# Altium project MB1419.PrjPcb (part 1 of 2)
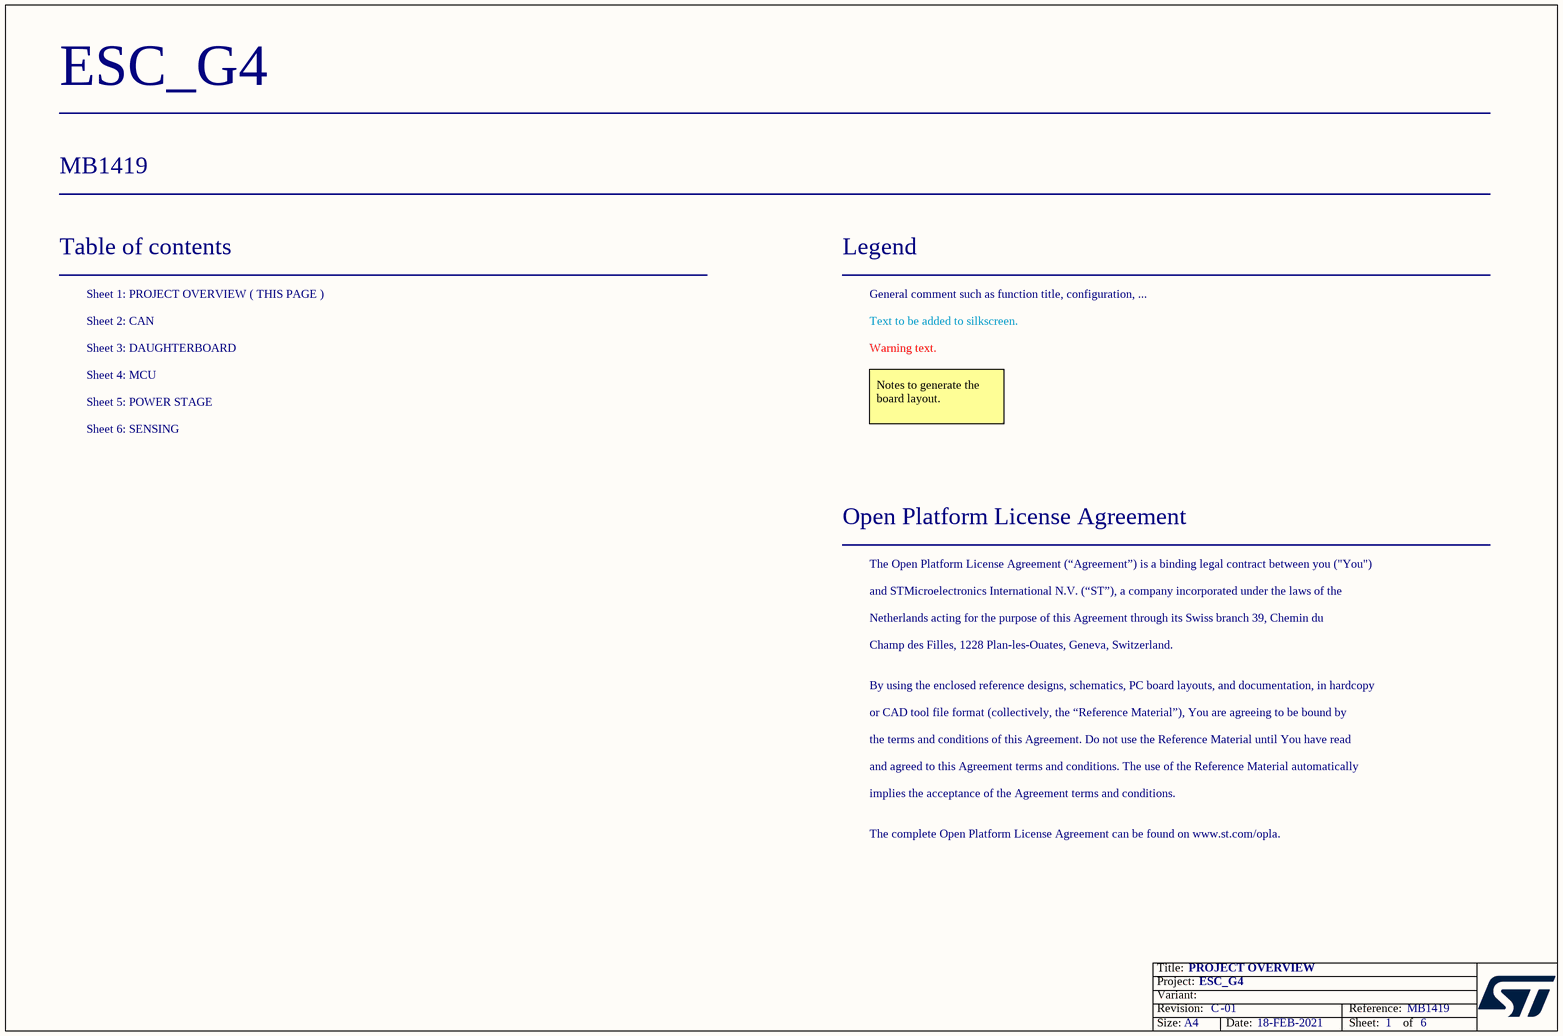
[diagram p0: Project_Overview.SchDoc]
Board_Reference: MB1419; Board_PCB_Revision: C; Board_Name: ESC_G4; Board_Document_Date: 18-FEB-2021; Board_Assembly_Revision: 01
6 sheets, 211 parts. Net scope: global (net labels, ports and power ports of the same name join across sheets).
Board file: MB1419.PcbDoc
Sheets:
  Project_Overview.SchDoc
  CAN.SchDoc
  DAUGHTERBOARD.SchDoc
  MCU.SchDoc
  POWER STAGE.SchDoc
  SENSING.SchDoc

## Sheet Project_Overview.SchDoc: PROJECT OVERVIEW
size A4; Date: Not used; ApprovedBy: Not used; CheckedBy: Not used; Author: Not used; CompanyName: STMicroelectronics; DrawnBy: Not used; Engineer: Not used; Organization: Not used; Address1: Not used; Address2: Not used; Address3: Not used; Address4: Not used; DocumentNumber: 1; Revision: Not used; SheetNumber: 1; SheetTotal: 6; CurrentTime: Not used; CurrentDate: Not used; Time: Not used; DocumentFullPathAndName: Not used; DocumentName: Not used; ModifiedDate: Not used; ImagePath: Not used; ProjectName: Not used; Application_BuildNumber: Not used

### Notes on the sheet
- Table of contents
- Sheet 1: PROJECT OVERVIEW ( THIS PAGE )
- Legend
- General comment such as function title, configuration, ...
- Sheet 2: CAN
- Sheet 3: DAUGHTERBOARD
- Sheet 4: MCU
- Text to be added to silkscreen.
- Warning text.
- Sheet 6: SENSING
- Sheet 5: POWER STAGE
- Notes to generate the board layout.
- Open Platform License Agreement
- The Open Platform License Agreement (“Agreement”) is a binding legal contract between you ("You")
- and STMicroelectronics International N.V. (“ST”), a company incorporated under the laws of the
- Netherlands acting for the purpose of this Agreement through its Swiss branch 39, Chemin du
- Champ des Filles, 1228 Plan-les-Ouates, Geneva, Switzerland.
- By using the enclosed reference designs, schematics, PC board layouts, and documentation, in hardcopy
- or CAD tool file format (collectively, the “Reference Material”), You are agreeing to be bound by
- the terms and conditions of this Agreement. Do not use the Reference Material until You have read
- and agreed to this Agreement terms and conditions. The use of the Reference Material automatically
- implies the acceptance of the Agreement terms and conditions.
- The complete Open Platform License Agreement can be found on www.st.com/opla.
- Title:
- Project:
- Size:
- Revision:
- Variant:
- A4
- -
- Date:
- Reference:
- Sheet:
- of

## Sheet CAN.SchDoc: CAN
size A4; DocumentNumber: 2; SheetNumber: 2; SheetTotal: 6
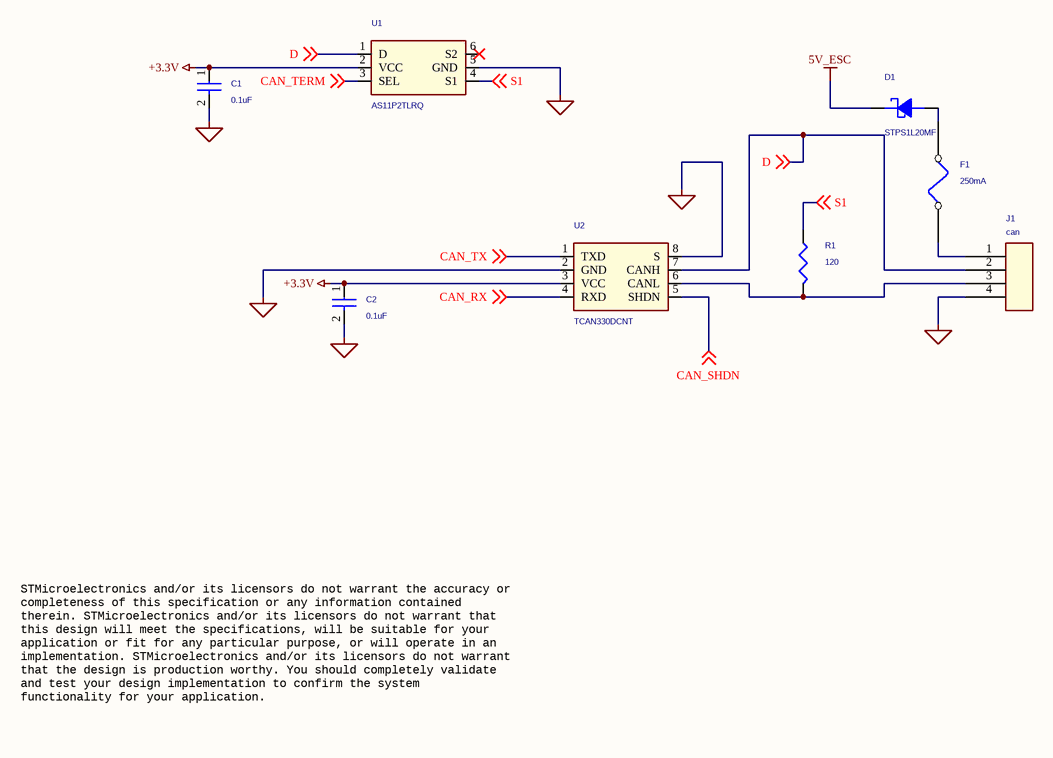
[diagram p1: CAN.SchDoc]

### Parts
C1  0.1uF  [C_0402]
C2  0.1uF  [C_0402]
D1  STPS1L20MF  [do216-aa-flat]
F1  250mA  [f_0402]
J1  can  [SOLDER_PAD_4PIN_SMD]
R1  120  [R_0402]
U1  AS11P2TLRQ  [son6p40_120x100x55l35x20]
U2  TCAN330DCNT  [sot23-8p65_280x145l45x30n]

### Nets
5V_ESC: D1.C
+3.3V: C1.1 C2.1 U1.2(VCC) U2.3(VCC)
GND_SIGNAL: C1.2 C2.2 J1.4 U1.5(GND) U2.2(GND) U2.8(S)  [project net GND]
CAN_RX: U2.4(RXD) ; off-sheet CAN_RX
CAN_SHDN: U2.5(SHDN) ; off-sheet CAN_SHDN
CAN_TERM: U1.3(SEL) ; off-sheet CAN_TERM
CAN_TX: U2.1(TXD) ; off-sheet CAN_TX
D: J1.2 U1.1(D) U2.7(CANH) ; off-sheet D
S1: R1.1 U1.4(S1) ; off-sheet S1
NetD1_A: D1.A F1.2
NetF1_1: F1.1 J1.1
NetJ1_3: J1.3 R1.2 U2.6(CANL)

Not connected (* = marked no-connect by the designer): U1 6(S2)*

### Notes on the sheet
- STMicroelectronics and/or its licensors do not warrant the accuracy or
  completeness of this specification or any information contained
  therein. STMicroelectronics and/or its licensors do not warrant that
  this design will meet the specifications, will be suitable for your
  application or fit for any particular purpose, or will operate in an
  implementation. STMicroelectronics and/or its licensors do not warrant
  that the design is production worthy. You should completely validate
  and test your design implementation to confirm the system
  functionality for your application.
- Title:
- Project:
- Size:
- Revision:
- Variant:
- A4
- -
- Date:
- Reference:
- Sheet:
- of

### Library data of the parts
C1 C2 = CAP_Dup1: CAP CER 0.1UF 16V X7R 0402; PART_NUMBER: CAP-00000053; Manufacturer: Wurth Electronics Inc.; Manufacturer PN: 885012205037; Dielectric Type: Capacitors; Tolerance: 10%; CLASS: DISCRETE; Package Size: 0402 (1005 Metric); Temperature Coefficient: X7R; Rated Voltage: 16V
D1 = DIODE_SCHOTTKY_0: DIODE SCHOTTKY 20V 1A STMITEFLAT; Manufacturer: STMicroelectronics; PART_NUMBER: TMP-380; CLASS: DISCRETE; Rated Voltage: 430mV @ 1A; Manufacturer PN: STPS1L20MF; Package Size: DO-222AA
F1 = FUSE: FUSE BOARD MNT 250MA 32VDC 0402; Manufacturer Code: 0435.250KRS; Manufacturer: Littelfuse Inc.; PART_NUMBER: TMP-439; RS/Distrelec/Other Code: MOUSER: 576-0435.250KRS; CLASS: DISCRETE; Package Size: 0.039" L x 0.020" W x 0.013" H (0.99mm x 0.51mm x 0.33mm); Manufacturer PN: 0435.250KRS
J1 = CON4: SOLDER PADS
R1 = RES: RES SMD 120 OHM 1% 1/16W 0402; PART_NUMBER: TMP-441; Manufacturer: Yageo; Manufacturer PN: RC0402FR-07120RL; Temperature Coefficient: 100ppm/C; Rated Power: 0.063W, 1/16W; CLASS: DISCRETE; Package Size: 0402 (1005 Metric); Tolerance: 1%
U1 = AS11P2TLR: IC ANLG SWITCH SGL SPDT 6QFN; Manufacturer: STMicroelectronics; PART_NUMBER: TMP-378; Manufacturer PN: AS11P2TLRQ; CLASS: IC; Package Size: 6-UFDFN
U2 = TCAN330: IC TXRX CAN 3.3V SOT-23; PART_NUMBER: TMP-379; Manufacturer: Texas Instruments; Supply Voltage: 3 V ~ 3.6 V; Package Size: SOT-23-8; CLASS: IC; Manufacturer PN: TCAN330DCNT

## Sheet DAUGHTERBOARD.SchDoc: Daughterboard
size A3; DocumentNumber: 3; SheetNumber: 3; SheetTotal: 6
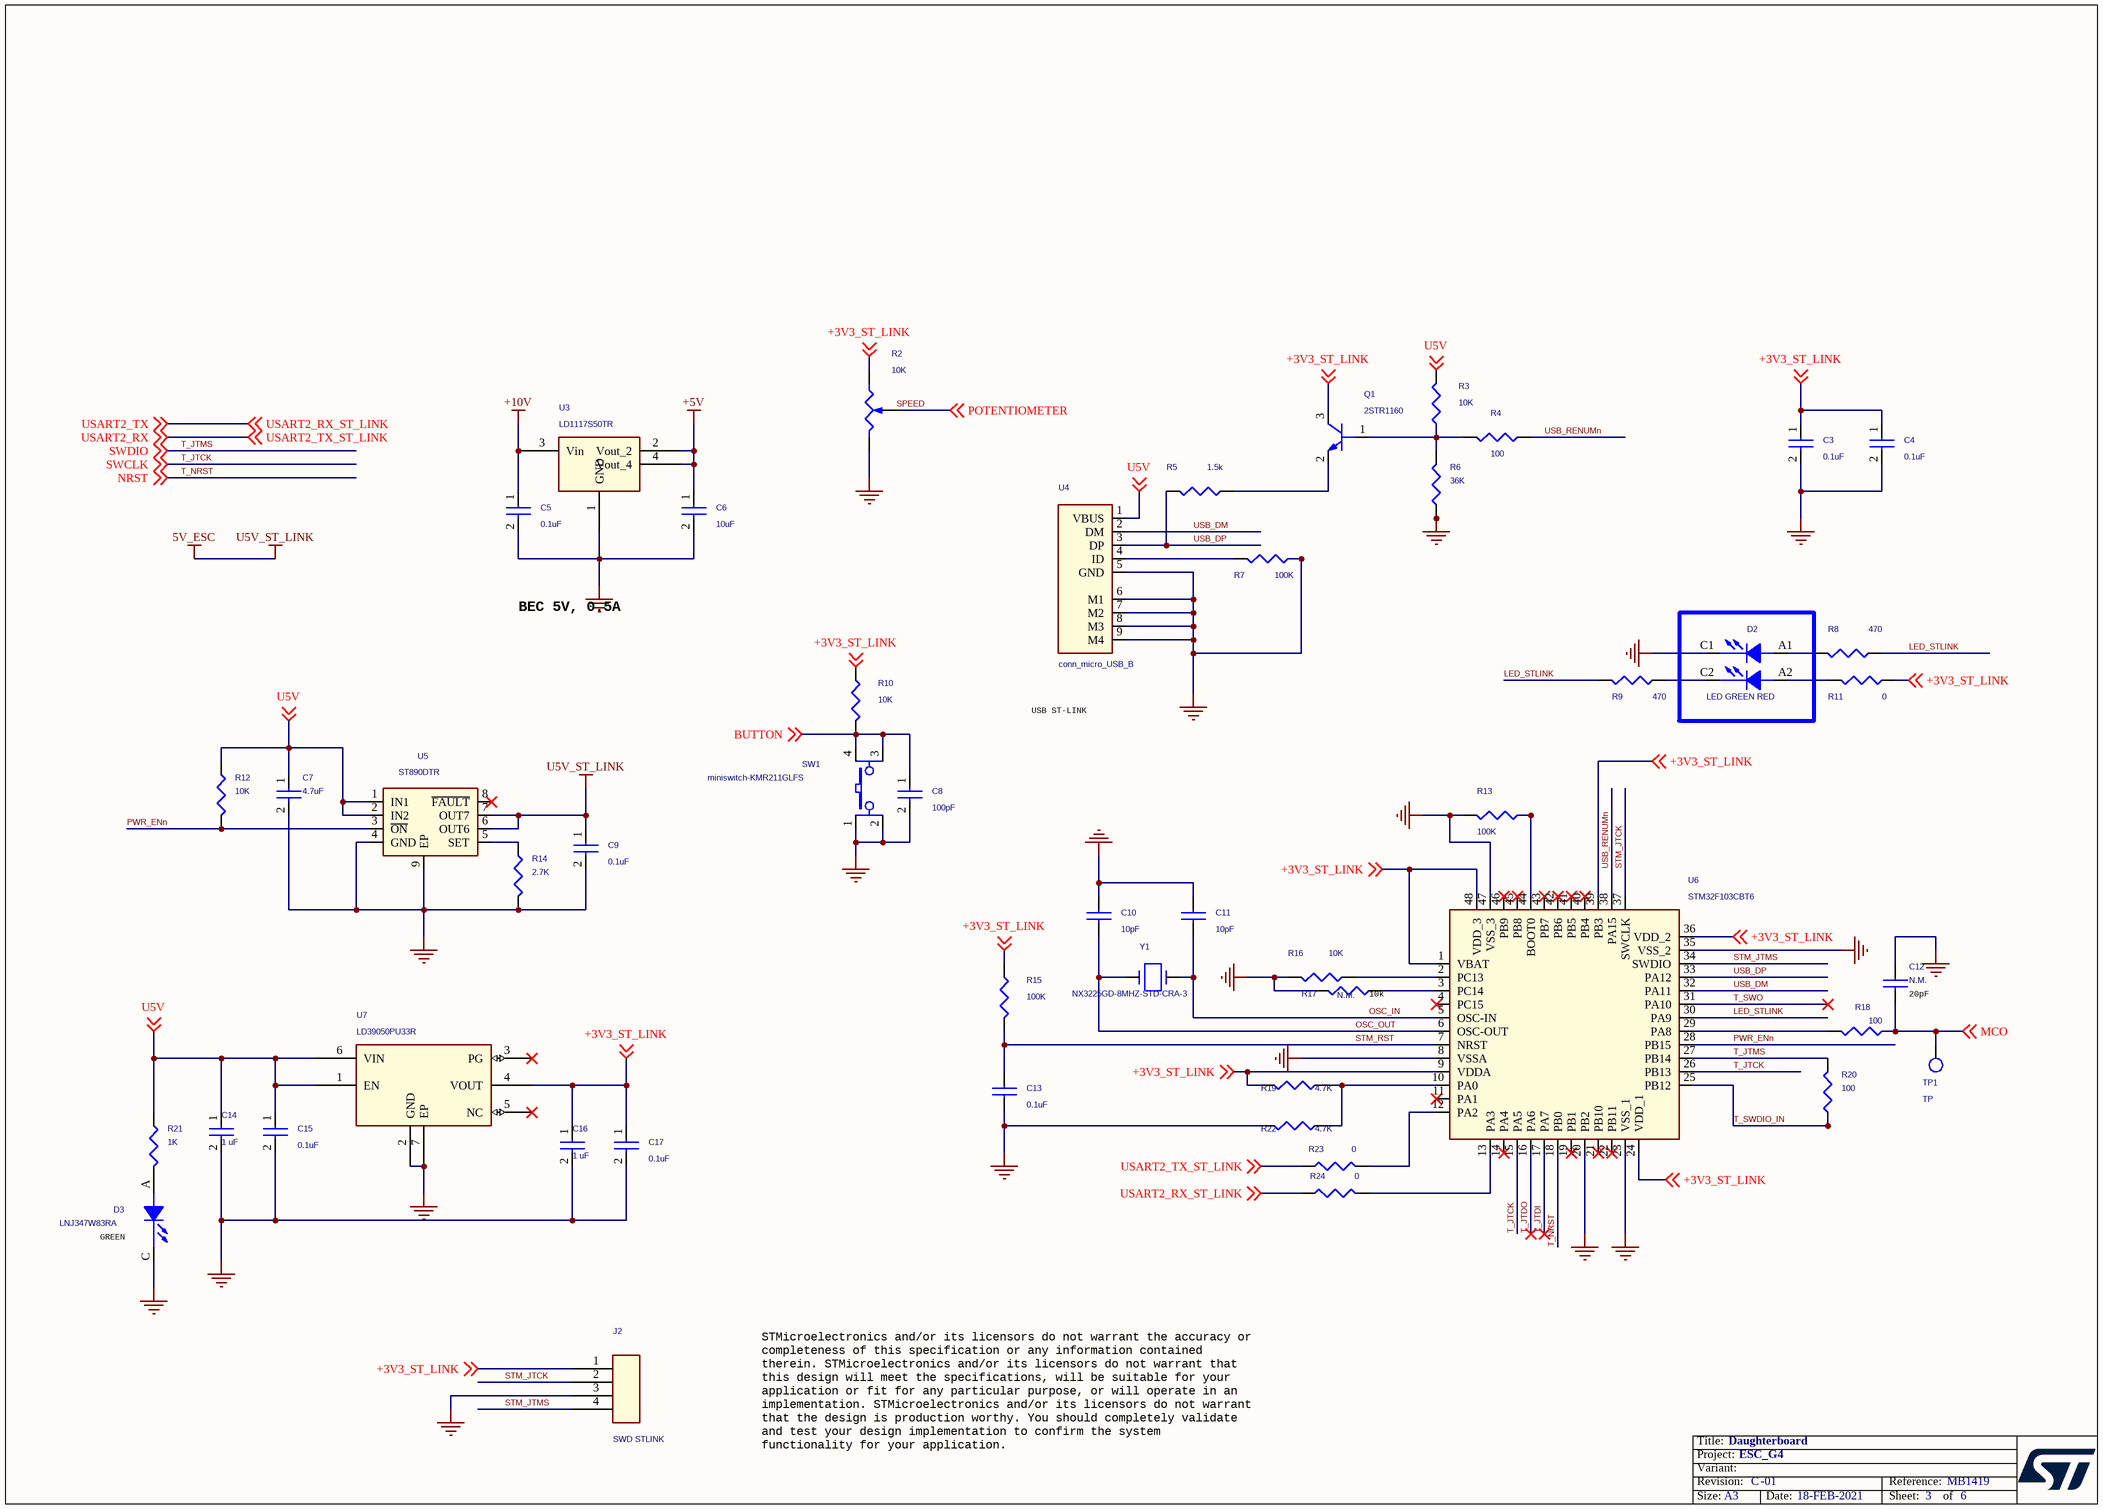
[diagram p2: DAUGHTERBOARD.SchDoc]

### Parts
C3  0.1uF  [C_0402]
C4  0.1uF  [C_0402]
C5  0.1uF  [C_0402]
C6  10uF  [C_0805]
C7  4.7uF  [C_0805]
C8  100pF  [C_0402]
C9  0.1uF  [C_0402]
C10  10pF  [C_0402]
C11  10pF  [C_0402]
C12  N.M.  [C_0402]
C13  0.1uF  [C_0402]
C14  1 uF  [C_0603]
C15  0.1uF  [C_0603]
C16  1 uF  [C_0603]
C17  0.1uF  [C_0402]
D2  LED GREEN RED  [Led_bicolor_3528-PLCC-4]
D3  LNJ347W83RA  [D_0402_Led_green]
J2  SWD STLINK  [strip4_100m_v]
Q1  2STR1160  [sot23-3p97_255x140l40x40n]
R2  10K  [trimmer-3386P_T]
R3  10K  [R_0402]
R4  100  [R_0402]
R5  1.5k  [R_0402]
R6  36K  [R_0402]
R7  100K  [R_0402]
R8  470  [R_0402]
R9  470  [R_0402]
R10  10K  [R_0402]
R11  0  [R_0402]
R12  10K  [R_0402]
R13  100K  [R_0402]
R14  2.7K  [R_0402]
R15  100K  [R_0402]
R16  10K  [R_0402]
R17  N.M.  [R_0402]
R18  100  [R_0402]
R19  4.7K  [R_0402]
R20  100  [R_0402]
R21  1K  [R_0402]
R22  4.7K  [R_0402]
R23  0  [JUMPER_0603_DROP]
R24  0  [JUMPER_0603_DROP]
SW1  miniswitch-KMR211GLFS  [switch_SMT_4_2x2_8mm]
TP1  TP  [test_point_100_smd]
U3  LD1117S50TR  [sot223-4p230_700x190l65x72]
U4  conn_micro_USB_B  [conn_micro_USB_B_SMD]
U5  ST890DTR  [son9p65_300x300x90l30x30t240-1]
U6  STM32F103CBT6  [qfp48p50_900x900x160l60x22n]
U7  LD39050PU33R  [son7p95_300x300x100l40x34t23-1]
Y1  NX3225GD-8MHZ-STD-CRA-3  [xtaldfn2_320x250x100l130x230]

### Nets
5V_ESC: C9.1 U5.6(OUT6) U5.7(OUT7)  [also labelled U5V_ST_LINK]
+5V: C6.1 U3.2(Vout_2) U3.4(Vout_4)
+10V: C5.1 U3.3(Vin)
GND: C3.2 C4.2 C5.2 C6.2 C7.2 C8.2 C9.2 C10.1 C11.1 C12.1 C13.2 C14.2 C15.2 C16.2 C17.2 D2.C1(CATHODE1) D3.C(CATHODE) J2.3 R2.1(A) R6.1 R7.1 R13.2 R14.2 R16.2 R17.2 R22.2 SW1.1 SW1.2 U3.1(GND) U4.5(GND) U4.6(M1) U4.7(M2) U4.8(M3) U4.9(M4) U5.4(GND) U5.9(EP) U6.8(VSSA) U6.20(PB2) U6.23(VSS_1) U6.35(VSS_2) U6.47(VSS_3) U7.2(GND) U7.7(EP)
+3V3_ST_LINK: C3.1 C4.1 C16.1 C17.1 J2.1 Q1.3(C) R2.3(B) R10.1 R11.1 R15.1 R19.2 U6.1(VBAT) U6.9(VDDA) U6.24(VDD_1) U6.36(VDD_2) U6.39(PB3) U6.48(VDD_3) U7.4(VOUT) ; off-sheet +3V3_ST_LINK
BUTTON: C8.1 R10.2 SW1.3 SW1.4 ; off-sheet BUTTON
LED_STLINK: R8.1 R9.2 U6.30(PA9)
MCO: C12.2 R18.1 TP1.1 ; off-sheet MCO
OSC_IN: C11.2 U6.5(OSC-IN) Y1.1
OSC_OUT: C10.2 U6.6(OSC-OUT) Y1.2
PWR_ENn: R12.2 U5.3(~{ON}) U6.28(PB15)
SPEED: R2.2(WIPER) ; off-sheet POTENTIOMETER  [also labelled POTENTIOMETER]
STM_JTCK: J2.2 U6.37(SWCLK)
STM_JTMS: J2.4 U6.34(SWDIO)
STM_RST: C13.1 R15.2 U6.7(NRST)
T_JTCK: U6.15(PA5) U6.26(PB13) ; off-sheet SWCLK  [also labelled SWCLK]
T_JTDI: U6.17(PA7)
T_JTDO: U6.16(PA6)
T_JTMS: R20.2 U6.27(PB14) ; off-sheet SWDIO  [also labelled SWDIO]
T_NRST: U6.18(PB0) ; off-sheet NRST  [also labelled NRST]
T_SWDIO_IN: R20.1 U6.25(PB12)
T_SWO: U6.31(PA10)
U5V: C7.1 C14.1 C15.1 R3.2 R12.1 R21.1 U4.1(VBUS) U5.1(IN1) U5.2(IN2) U7.1(EN) U7.6(VIN) ; off-sheet U5V
USART2_RX: R23.1 ; off-sheet USART2_TX_ST_LINK, off-sheet USART2_RX  [also labelled USART2_TX_ST_LINK]
USART2_RX_ST_LINK: R24.1 ; off-sheet USART2_RX_ST_LINK, off-sheet USART2_TX  [also labelled USART2_TX]
USB_DM: U4.2(DM) U6.32(PA11)
USB_DP: R5.2 U4.3(DP) U6.33(PA12)
USB_RENUMn: R4.1 U6.38(PA15)
NetD2_A1: D2.A1(ANODE1) R8.2
NetD2_A2: D2.A2(ANODE2) R11.2
NetD2_C2: D2.C2(CATHODE2) R9.1
NetD3_A: D3.A(ANODE) R21.2
NetQ1_1: Q1.1(B) R3.1 R4.2 R6.2
NetQ1_2: Q1.2(E) R5.1
NetR7_2: R7.2 U4.4(ID)
NetR13_1: R13.1 U6.44(BOOT0)
NetR14_1: R14.1 U5.5(SET)
NetR16_1: R16.1 U6.2(PC13)
NetR17_1: R17.1 U6.3(PC14)
NetR18_2: R18.2 U6.29(PA8)
NetR19_1: R19.1 R22.1 U6.10(PA0)
NetR23_2: R23.2 U6.12(PA2)
NetR24_2: R24.2 U6.13(PA3)

Not connected (* = marked no-connect by the designer): U5 8(~{FAULT})*; U6 4(PC15)* 11(PA1)* 14(PA4)* 19(PB1)* 21(PB10)* 22(PB11)* 40(PB4)* 41(PB5)* 42(PB6)* 43(PB7)* 45(PB8)* 46(PB9)*; U7 3(PG)* 5(NC)*

### Notes on the sheet
- BEC 5V, 0.5A
- USB ST-LINK
- (near R17) 10k
- (near C12) 20pF
- (near D3) GREEN
- STMicroelectronics and/or its licensors do not warrant the accuracy or
  completeness of this specification or any information contained
  therein. STMicroelectronics and/or its licensors do not warrant that
  this design will meet the specifications, will be suitable for your
  application or fit for any particular purpose, or will operate in an
  implementation. STMicroelectronics and/or its licensors do not warrant
  that the design is production worthy. You should completely validate
  and test your design implementation to confirm the system
  functionality for your application.
- Title:
- Project:
- Size:
- Revision:
- Variant:
- A3
- -
- Date:
- Reference:
- Sheet:
- of

### Library data of the parts
C3-C5 C9 = CAP_Dup1: CAP CER 0.1UF 16V X7R 0402; Manufacturer PN: 885012205037; Manufacturer: Wurth Electronics Inc.; PART_NUMBER: CAP-00000053; CLASS: DISCRETE; Tolerance: 10%; Dielectric Type: Capacitors; Rated Voltage: 16V; Temperature Coefficient: X7R; Package Size: 0402 (1005 Metric)
C6 = CAP_Dup1: CAP CER 10UF 16V X5R 0805; Manufacturer PN: 885012107014; Manufacturer: Wurth Electronics Inc.; PART_NUMBER: TMP-409; CLASS: DISCRETE; Tolerance: 20%; Dielectric Type: Capacitors; Rated Voltage: 16V; Temperature Coefficient: X5R; Package Size: 0805 (2012 Metric)
C7 = CAP_Dup1: CAP CER 4.7UF 16V X5R 0805; PART_NUMBER: TMP-410; Manufacturer: Wurth Electronics Inc.; Manufacturer PN: 885012107013; Dielectric Type: Capacitors; Tolerance: 20%; CLASS: DISCRETE; Package Size: 0805 (2012 Metric); Temperature Coefficient: X5R; Rated Voltage: 16V
C8 = CAP_Dup1: CAP CER 100PF 10V C0G/NP0 0402; PART_NUMBER: TMP-412; Manufacturer: Wurth Electronics Inc.; Manufacturer PN: 885012005013; Dielectric Type: Capacitors; Temperature Coefficient: C0G, NP0; Tolerance: 5%; CLASS: DISCRETE; Package Size: 0402 (1005 Metric); Rated Voltage: 10V
C10 C11 = CAP_7: CAP CER 10PF 10V C0G/NP0 0402; PART_NUMBER: TMP-395; Manufacturer: Wurth Electronics Inc.; Manufacturer PN: 885012005007; Dielectric Type: Capacitors; Temperature Coefficient: C0G, NP0; Tolerance: 5%; CLASS: DISCRETE; Package Size: 0402 (1005 Metric); Rated Voltage: 10V
C12 = CAP_6: CAP CER 0402-NOT MOUNTED; PART_NUMBER: TMP-408; CLASS: DISCRETE; Package Size: 0402 (1005 Metric)
C13 = CAP_8: CAP CER 0.1UF 16V X7R 0402; PART_NUMBER: CAP-00000053; Manufacturer: Wurth Electronics Inc.; Manufacturer PN: 885012205037; Dielectric Type: Capacitors; Tolerance: 10%; CLASS: DISCRETE; Package Size: 0402 (1005 Metric); Temperature Coefficient: X7R; Rated Voltage: 16V
C14 C16 = CAP_Dup1: CAP CER 1UF 16V X5R 0603; PART_NUMBER: TMP-302; Manufacturer: Yageo; Manufacturer PN: CC0603KRX5R7BB105; Dielectric Type: Capacitors; Tolerance: 10%; CLASS: DISCRETE; Package Size: 0603 (1608 Metric); Temperature Coefficient: X5R; Rated Voltage: 16V
C15 = CAP_Dup1: CAP CER 0.1UF 16V X7R 0603; Manufacturer PN: 885012206046; Manufacturer: Wurth Electronics Inc.; PART_NUMBER: CAP-00000052; CLASS: DISCRETE; Tolerance: 10%; Dielectric Type: Capacitors; Rated Voltage: 16V; Temperature Coefficient: X7R; Package Size: 0603 (1608 Metric)
C17 = CAP_Dup1: as C1 on sheet CAN; Package Size: 0402 (1005 Metric); Temperature Coefficient: X7R; Rated Voltage: 16V
D2 = LED_BICOLOR: LED GREEN/RED CLEAR 4PLCC SMD; PART_NUMBER: TMP-705; Manufacturer: Wurth Electronics Inc.; Manufacturer PN: 150141RV73100; CLASS: DISCRETE; Package Size: 4-PLCC
D3 = LED: LED GREEN 0402 SMD; Manufacturer PN: 16-213SYGC/S530-E3/TR8; Manufacturer: Everlight Electronics; PART_NUMBER: TMP-187; CLASS: DISCRETE; Package Size: 0402 (1005 Metric)
J2 = CON4: SOLDER PADS
Q1 = BJT_NPN_BEC: TRANS NPN 60V 1A SOT-23; PART_NUMBER: TMP-433; Manufacturer: STMicroelectronics; CLASS: DISCRETE; Package Size: TO-236-3, SC-59, SOT-23-3; Polarity: NPN; Manufacturer PN: 2STR1160
R2 = POT: TRIMMER 10K OHM 0.5W PC PIN; PART_NUMBER: TMP-491; Manufacturer: Bourns Inc.; Manufacturer PN: 3386P-1-103TLF; Temperature Coefficient: 100ppm/C; Tolerance: 10%; Rated Power: 0.5W, 1/2W; CLASS: DISCRETE; Package Size: Square - 0.375" x 0.375" Face x 0.190" H (9.53mm x 9.53mm x 4.83mm)
R3 R12 = RES: RES SMD 10K OHM 1% 1/16W 0402; Manufacturer PN: RC0402FR-0710KL; Manufacturer: Yageo; PART_NUMBER: TMP-396; CLASS: DISCRETE; Rated Power: 0.063W, 1/16W; Temperature Coefficient: 100ppm/C; Tolerance: 1%; Package Size: 0402 (1005 Metric)
R4 R8 R20 = RES: RES SMD 100 OHM 1% 1/16W 0402; PART_NUMBER: TMP-406; Manufacturer: TE Connectivity Passive Product; Manufacturer PN: CRG0402F100R; Temperature Coefficient: 100ppm/C; Rated Power: 0.063W, 1/16W; CLASS: DISCRETE; Package Size: 0402 (1005 Metric); Tolerance: 1%
R5 = RES: RES SMD 1.5K OHM 1% 1/16W 0402; PART_NUMBER: TMP-393; Manufacturer: Yageo; Manufacturer PN: RC0402FR-071K5L; Temperature Coefficient: 100ppm/C; Rated Power: 0.063W, 1/16W; CLASS: DISCRETE; Package Size: 0402 (1005 Metric); Tolerance: 1%
R6 = RES: RES SMD 36K OHM 1% 1/16W 0402; Manufacturer PN: RC0402FR-0736KL; Manufacturer: Yageo; PART_NUMBER: TMP-436; CLASS: DISCRETE; Rated Power: 0.063W, 1/16W; Temperature Coefficient: 100ppm/C; Tolerance: 1%; Package Size: 0402 (1005 Metric)
R7 R13 = RES: RES SMD 100K OHM 1% 1/16W 0402; Manufacturer PN: CRG0402F100K; Manufacturer: TE Connectivity Passive Product; PART_NUMBER: TMP-405; CLASS: DISCRETE; Rated Power: 0.063W, 1/16W; Temperature Coefficient: 100ppm/C; Tolerance: 1%; Package Size: 0402 (1005 Metric)
R9 R18 = RES: RES SMD 100 OHM 1% 1/16W 0402; Manufacturer PN: CRG0402F100R; Manufacturer: TE Connectivity Passive Product; PART_NUMBER: TMP-406; CLASS: DISCRETE; Rated Power: 0.063W, 1/16W; Temperature Coefficient: 100ppm/C; Tolerance: 1%; Package Size: 0402 (1005 Metric)
R10 R16 = RES: RES SMD 10K OHM 1% 1/16W 0402; PART_NUMBER: TMP-396; Manufacturer: Yageo; Manufacturer PN: RC0402FR-0710KL; Temperature Coefficient: 100ppm/C; Rated Power: 0.063W, 1/16W; CLASS: DISCRETE; Package Size: 0402 (1005 Metric); Tolerance: 1%
R11 = RES: RES SMD 0 OHM JUMPER 1/16W 0402; Manufacturer PN: CRCW04020000Z0ED; Manufacturer: Vishay Dale; PART_NUMBER: RES-00000073; CLASS: DISCRETE; Rated Power: 0.063W, 1/16W; Tolerance: Jumper; Temperature Coefficient: -; Package Size: 0402 (1005 Metric)
R14 = RES: RES SMD 2.7K OHM 1% 1/16W 0402; PART_NUMBER: TMP-411; Manufacturer: Yageo; Manufacturer PN: RC0402FR-072K7L; Temperature Coefficient: 100ppm/C; Rated Power: 0.063W, 1/16W; CLASS: DISCRETE; Package Size: 0402 (1005 Metric); Tolerance: 1%
R15 = RES: RES SMD 100K OHM 1% 1/16W 0402; PART_NUMBER: TMP-405; Manufacturer: TE Connectivity Passive Product; Manufacturer PN: CRG0402F100K; Temperature Coefficient: 100ppm/C; Rated Power: 0.063W, 1/16W; CLASS: DISCRETE; Package Size: 0402 (1005 Metric); Tolerance: 1%
R17 = RES: RES SMD 0402 - NOT MOUNTED; PART_NUMBER: TMP-404; CLASS: DISCRETE; Package Size: 0402 (1005 Metric)
R19 R22 = RES: RES SMD 4.7K OHM 1% 1/16W 0402; PART_NUMBER: TMP-403; Manufacturer: TE Connectivity Passive Product; Manufacturer PN: CRG0402F4K7; Temperature Coefficient: 100ppm/C; Rated Power: 0.063W, 1/16W; CLASS: DISCRETE; Package Size: 0402 (1005 Metric); Tolerance: 1%
R21 = RES: RES SMD 1K OHM 1% 1/16W 0402; PART_NUMBER: TMP-352; Manufacturer: Yageo; Manufacturer PN: RC0402FR-071KL; Temperature Coefficient: 100ppm/C; Rated Power: 0.063W, 1/16W; CLASS: DISCRETE; ALT_SYMBOLS: r_0402_hd; Package Size: 0402 (1005 Metric); Tolerance: 1%
R23 = RES: RES SMD 0 OHM JUMPER 1/10W 0603; Manufacturer PN: ERJ-3GEY0R00V; Manufacturer: Panasonic Electronic Components; PART_NUMBER: RES-00000056; CLASS: DISCRETE; Rated Power: 0.1W, 1/10W; Tolerance: Jumper; Temperature Coefficient: -; Package Size: 0603 (1608 Metric)
R24 = RES: RES SMD 0 OHM JUMPER 1/10W 0603; PART_NUMBER: RES-00000056; Manufacturer: Panasonic Electronic Components; Manufacturer PN: ERJ-3GEY0R00V; Rated Power: 0.1W, 1/10W; CLASS: DISCRETE; Package Size: 0603 (1608 Metric); Temperature Coefficient: -; Tolerance: Jumper
SW1 = PUSHBUTTON-SPST-2: SWITCH TACTILE SPST-NO 0.05A 32V; Manufacturer: C&K; PART_NUMBER: TMP-285; CLASS: DISCRETE; Manufacturer PN: KMR211GLFS; Package Size: 4.60mm x 2.80mm
TP1 = TESTPOINT: TEST POINT 1MM  SMD PADSTASCK; PART_NUMBER: TMP-386; CLASS: IO
U3 = LD1117SxxxTR_0: IC REG LINEAR 5V 800MA SOT223; Manufacturer: STMicroelectronics; PART_NUMBER: TMP-381; Manufacturer PN: LD1117S50TR; CLASS: IC; Package Size: TO-261-4, TO-261AA
U4 = USB_MICRO: CONN RCPT 5POS MICRO USB R/A; Manufacturer PN: 0473460001; Manufacturer: Molex, LLC; PART_NUMBER: TMP-434; CLASS: IO
U5 = ST890DTR: IC PWR SWITCH 1.2A HISIDE 8-DFN; Manufacturer: STMicroelectronics; PART_NUMBER: TMP-432; Supply Voltage: Not Required; Manufacturer PN: ST890DTR; CLASS: IC; Package Size: 8-VDFN Exposed Pad
U6 = STM32F103CBT6: IC MCU 32BIT 128KB FLASH 48LQFP; PART_NUMBER: TMP-399; Manufacturer: STMicroelectronics; Supply Voltage: 2 V ~ 3.6 V; Package Size: 48-LQFP; CLASS: IC; Manufacturer PN: STM32F103CBT6
U7 = LD39050PU33R: IC REG LINEAR 3.3V 500MA 6DFN; PART_NUMBER: TMP-358; Manufacturer: STMicroelectronics; Package Size: 6-VDFN Exposed Pad; CLASS: IC; Manufacturer PN: LD39050PU33R
Y1 = crystal: CRYSTAL 8.0000MHZ 8PF SMD; Manufacturer: NDK America, Inc.; PART_NUMBER: TMP-435; CLASS: DISCRETE; Frequency Tolerance: 50ppm; Frequency Stability: 150ppm; Manufacturer PN: NX3225GD-8MHZ-STD-CRA-3; Package Size: 0.126" L x 0.098" W (3.20mm x 2.50mm)

## Sheet MCU.SchDoc: MCU
size A3; DocumentNumber: 4; SheetNumber: 4; SheetTotal: 6
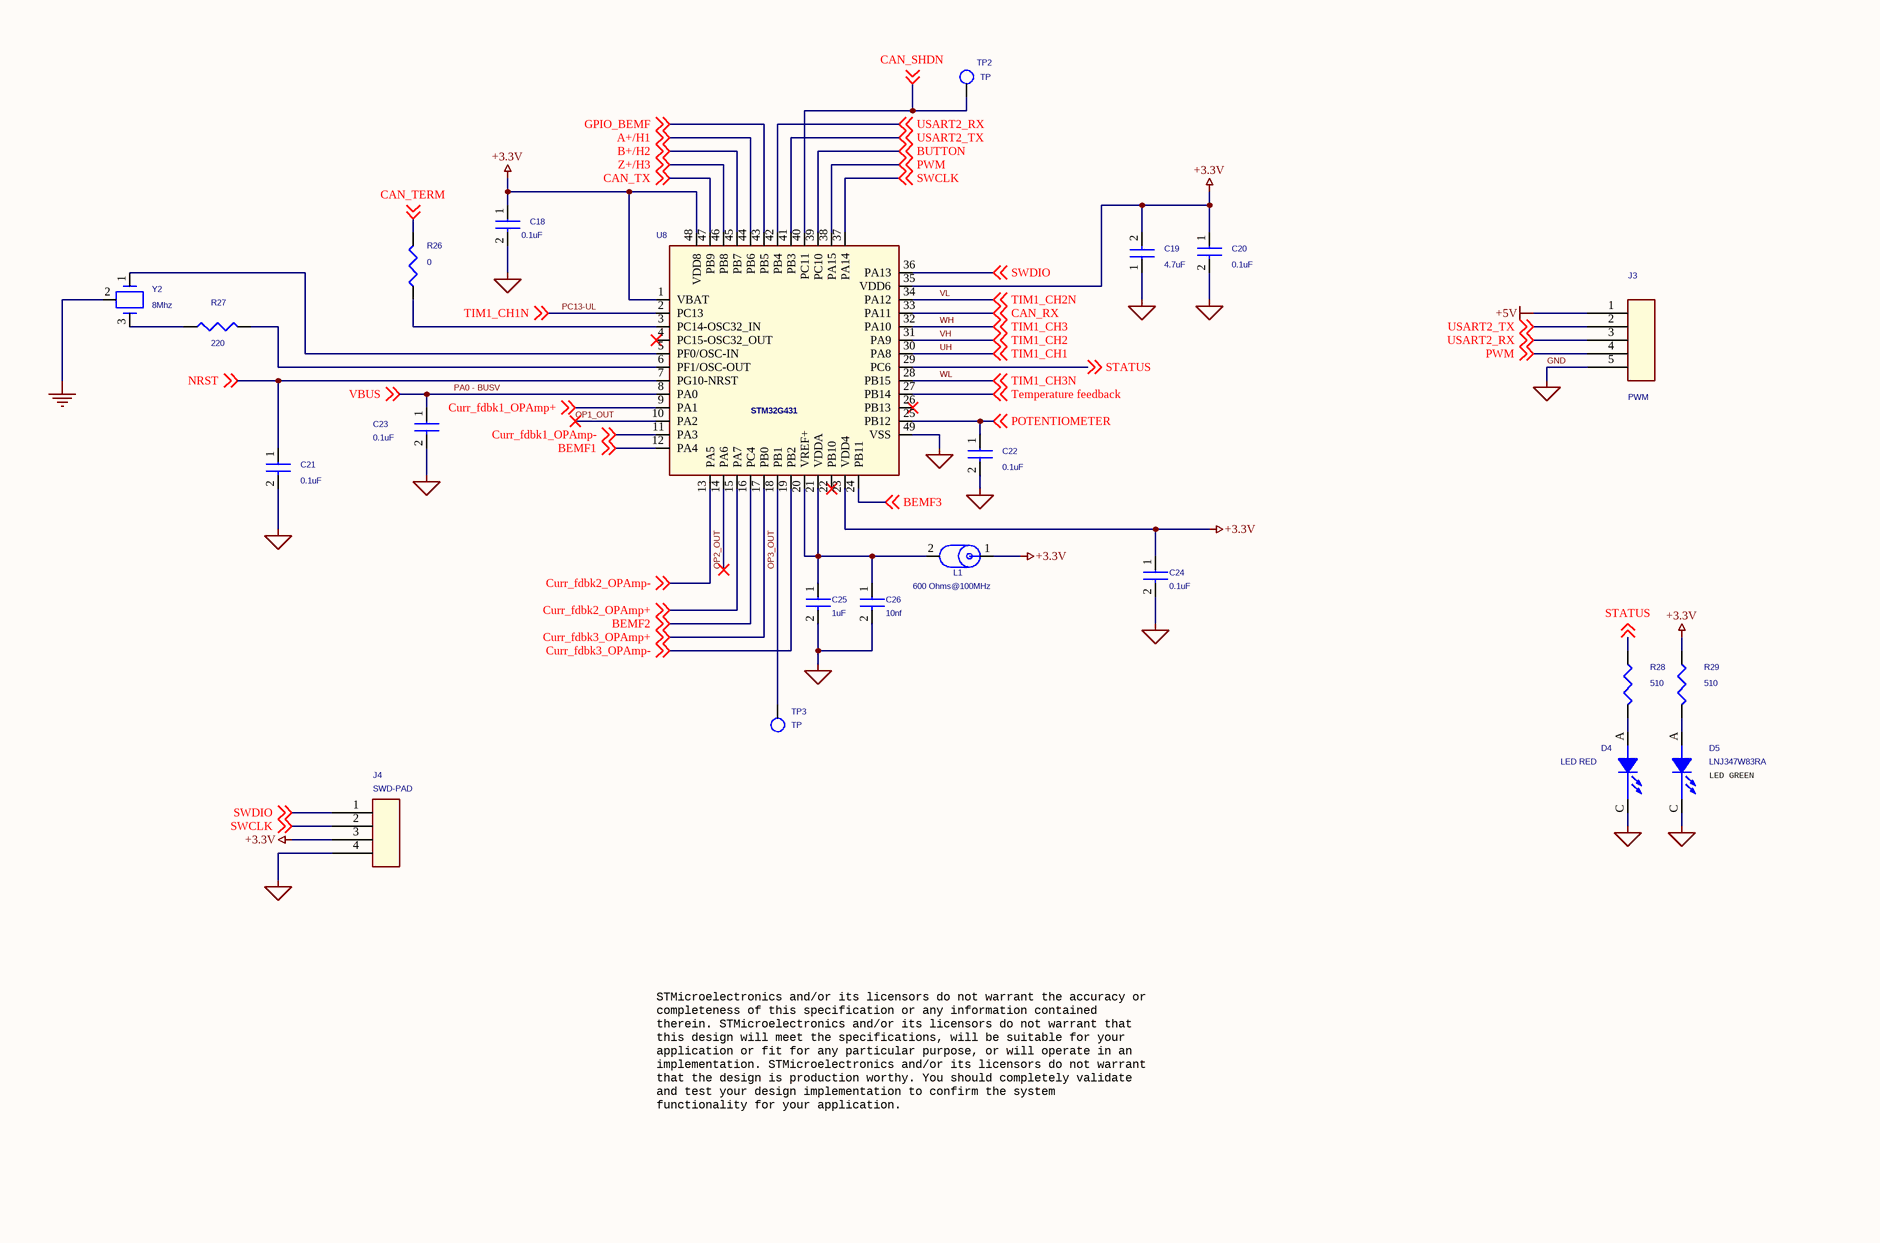
[diagram p3: MCU.SchDoc, top left]
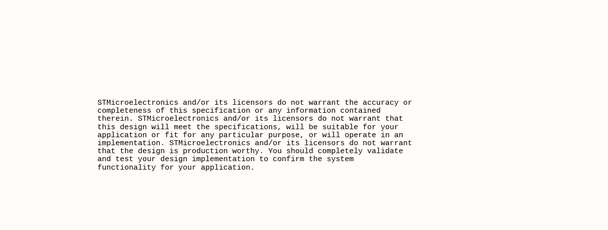
[diagram p4: MCU.SchDoc, bottom right]

### Parts
C18  0.1uF  [C_0402]
C19  4.7uF  [C_0603]
C20  0.1uF  [C_0402]
C21  0.1uF  [C_0402]
C22  0.1uF  [C_0402]
C23  0.1uF  [C_0402]
C24  0.1uF  [C_0402]
C25  1uF  [C_0402]
C26  10nf  [C_0402]
D4  LED RED  [D_0402_Led_red]
D5  LNJ347W83RA  [D_0402_Led_green]
J3  PWM  [SOLDER_PAD_5PIN_SMD]
J4  SWD-PAD  [SOLDER_PAD_4PIN_rect_SMD]
L1  600 Ohms@100MHz  [L_0402]
R26  0  [R_0402]
R27  220  [R_0402]
R28  510  [R_0402]
R29  510  [R_0402]
TP2  TP  [test_point_100_smd]
TP3  TP  [test_point_100_smd]
U8  STM32G431  [qfn49p50_700x700x60l40x25t560n]
Y2  8Mhz  [murata_cstce8m00g15c99-r0]

### Nets
+3.3V: C18.1 C19.2 C20.1 C24.1 J4.3 L1.1 R29.1 U8.1(VBAT) U8.23(VDD4) U8.35(VDD6) U8.48(VDD8)
+5V: J3.1
GND: C18.2 C19.1 C20.2 C21.2 C22.2 C23.2 C24.2 C25.2 C26.2 D4.C(CATHODE) D5.C(CATHODE) J3.5 J4.4 U8.49(VSS) Y2.2  [also labelled GND_SIGNAL]
A+/H1: U8.44(PB6) ; off-sheet A+/H1
B+/H2: U8.45(PB7) ; off-sheet B+/H2
BEMF1: U8.12(PA4) ; off-sheet BEMF1
BEMF2: U8.16(PC4) ; off-sheet BEMF2
BEMF3: U8.24(PB11) ; off-sheet BEMF3
BUTTON: U8.39(PC10) ; off-sheet BUTTON
CAN_RX: U8.33(PA11) ; off-sheet CAN_RX
CAN_SHDN: TP2.1 U8.40(PC11) ; off-sheet CAN_SHDN
CAN_TERM: R26.2 ; off-sheet CAN_TERM
CAN_TX: U8.47(PB9) ; off-sheet CAN_TX
Curr_fdbk1_OPAmp+: U8.9(PA1) ; off-sheet Curr_fdbk1_OPAmp+
Curr_fdbk1_OPAmp-: U8.11(PA3) ; off-sheet Curr_fdbk1_OPAmp-
Curr_fdbk2_OPAmp+: U8.15(PA7) ; off-sheet Curr_fdbk2_OPAmp+
Curr_fdbk2_OPAmp-: U8.13(PA5) ; off-sheet Curr_fdbk2_OPAmp-
Curr_fdbk3_OPAmp+: U8.17(PB0) ; off-sheet Curr_fdbk3_OPAmp+
Curr_fdbk3_OPAmp-: U8.19(PB2) ; off-sheet Curr_fdbk3_OPAmp-
GPIO_BEMF: U8.43(PB5) ; off-sheet GPIO_BEMF
NRST: C21.1 U8.7(PG10-NRST) ; off-sheet NRST  [project net T_NRST]
OP1_OUT: U8.10(PA2)
OP2_OUT: U8.14(PA6)
OP3_OUT: TP3.1 U8.18(PB1)
PA0 - BUSV: C23.1 U8.8(PA0) ; off-sheet VBUS  [also labelled VBUS]
PC13-UL: U8.2(PC13) ; off-sheet TIM1_CH1N  [also labelled TIM1_CH1N]
POTENTIOMETER: C22.1 U8.25(PB12) ; off-sheet POTENTIOMETER  [project net SPEED]
PWM: J3.4 U8.38(PA15) ; off-sheet PWM
STATUS: R28.1 U8.29(PC6) ; off-sheet STATUS
SWCLK: J4.2 U8.37(PA14) ; off-sheet SWCLK  [project net T_JTCK]
SWDIO: J4.1 U8.36(PA13) ; off-sheet SWDIO  [project net T_JTMS]
Temperature feedback: U8.27(PB14) ; off-sheet Temperature feedback
UH: U8.30(PA8) ; off-sheet TIM1_CH1  [also labelled TIM1_CH1]
USART2_RX: J3.3 U8.42(PB4) ; off-sheet USART2_RX
USART2_TX: J3.2 U8.41(PB3) ; off-sheet USART2_TX  [project net USART2_RX_ST_LINK]
VH: U8.31(PA9) ; off-sheet TIM1_CH2  [also labelled TIM1_CH2]
VL: U8.34(PA12) ; off-sheet TIM1_CH2N  [also labelled TIM1_CH2N]
WH: U8.32(PA10) ; off-sheet TIM1_CH3  [also labelled TIM1_CH3]
WL: U8.28(PB15) ; off-sheet TIM1_CH3N  [also labelled TIM1_CH3N]
Z+/H3: U8.46(PB8) ; off-sheet Z+/H3
NetC25_1: C25.1 C26.1 L1.2 U8.20(VREF+) U8.21(VDDA)
NetD4_A: D4.A(ANODE) R28.2
NetD5_A: D5.A(ANODE) R29.2
NetR26_1: R26.1 U8.3(PC14-OSC32_IN)
NetR27_1: R27.1 Y2.3
NetR27_2: R27.2 U8.6(PF1/OSC-OUT)
NetU8_5: U8.5(PF0/OSC-IN) Y2.1

Not connected (* = marked no-connect by the designer): U8 4(PC15-OSC32_OUT)* 22(PB10)* 26(PB13)*

### Notes on the sheet
- (near D5) LED GREEN
- STMicroelectronics and/or its licensors do not warrant the accuracy or
  completeness of this specification or any information contained
  therein. STMicroelectronics and/or its licensors do not warrant that
  this design will meet the specifications, will be suitable for your
  application or fit for any particular purpose, or will operate in an
  implementation. STMicroelectronics and/or its licensors do not warrant
  that the design is production worthy. You should completely validate
  and test your design implementation to confirm the system
  functionality for your application.
- Title:
- Project:
- Size:
- Revision:
- Variant:
- A3
- -
- Date:
- Reference:
- Sheet:
- of

### Library data of the parts
C18 C22 = CAP_Dup1: as C1 on sheet CAN; Package Size: 0402 (1005 Metric); Temperature Coefficient: X7R; Rated Voltage: 16V
C19 = CAP_Dup1: CAP CER 4.7UF 10V X5R 0603; Manufacturer PN: 885012106012; Manufacturer: Wurth Electronics Inc.; PART_NUMBER: TMP-414; CLASS: DISCRETE; Tolerance: 20%; Dielectric Type: Capacitors; Rated Voltage: 10V; Temperature Coefficient: X5R; Package Size: 0603 (1608 Metric)
C20 C21 C23 C24 = CAP_Dup1: as C3 on sheet DAUGHTERBOARD; Rated Voltage: 16V; Temperature Coefficient: X7R; Package Size: 0402 (1005 Metric)
C25 = CAP_Dup1: CAP CER 1UF 25V X5R 0402; PART_NUMBER: CAP-00000006; Manufacturer: Murata Electronics North America; Manufacturer PN: GRM155R61E105KA12D; Dielectric Type: Capacitors; Tolerance: 10%; CLASS: DISCRETE; Package Size: 0402 (1005 Metric); Temperature Coefficient: X5R; Rated Voltage: 25V
C26 = CAP_Dup1: CAP CER 10000PF 16V X7R 0402; PART_NUMBER: TMP-422; Manufacturer: Wurth Electronics Inc.; Manufacturer PN: 885012205031; Dielectric Type: Capacitors; Tolerance: 10%; CLASS: DISCRETE; Package Size: 0402 (1005 Metric); Temperature Coefficient: X7R; Rated Voltage: 16V
D4 = LED: DIO, Rectangle with Flat Top, 1.00mm x 0.50mm, VLMS1500-GS08, 20mA, --, --, 0402 (1005 Metric); PART_NUMBER: DIO-00000003; Manufacturer: Vishay Semiconductor Opto Division; CLASS: DISCRETE; Package Size: 0402 (1005 Metric); Manufacturer PN: VLMS1500-GS08
D5 = LED: LED GREEN 0402 SMD; PART_NUMBER: TMP-187; Manufacturer: Everlight Electronics; Manufacturer PN: 16-213SYGC/S530-E3/TR8; CLASS: DISCRETE; Package Size: 0402 (1005 Metric)
J3 = CON5: SOLDER PADS
J4 = CON4: SOLDER PADS
L1 = IND_FB: FERRITE BEAD 600 OHM 0402 1LN; Manufacturer PN: BLM15BX601SN1D; Manufacturer: Murata Electronics North America; PART_NUMBER: TMP-492; CLASS: DISCRETE; Package Size: 0402 (1005 Metric)
R26 = RES: RES SMD 0 OHM JUMPER 1/16W 0402; PART_NUMBER: RES-00000073; Manufacturer: Vishay Dale; Manufacturer PN: CRCW04020000Z0ED; Rated Power: 0.063W, 1/16W; CLASS: DISCRETE; Package Size: 0402 (1005 Metric); Temperature Coefficient: -; Tolerance: Jumper
R27 = RES: RES SMD 220 OHM 1% 1/16W 0402; PART_NUMBER: TMP-437; Manufacturer: Yageo; Manufacturer PN: RC0402FR-07220RL; Temperature Coefficient: 100ppm/C; Rated Power: 0.063W, 1/16W; CLASS: DISCRETE; Package Size: 0402 (1005 Metric); Tolerance: 1%
R28 R29 = RES: RES SMD 510 OHM 1% 1/16W 0402; PART_NUMBER: TMP-438; Manufacturer: Yageo; Manufacturer PN: RC0402FR-07510RL; Temperature Coefficient: 100ppm/C; Rated Power: 0.063W, 1/16W; CLASS: DISCRETE; Package Size: 0402 (1005 Metric); Tolerance: 1%
TP2 TP3 = TESTPOINT: as TP1 on sheet DAUGHTERBOARD
U8 = STM32_LQFP64_6
Y2 = resonator: CER RES 8.0000MHZ 33PF SMD; Manufacturer PN: CSTNE8M00GH5C000R0; Manufacturer: Murata Electronics North America; PART_NUMBER: TMP-382; CLASS: DISCRETE; Frequency Tolerance: 0.1%; Frequency Stability: 0.13%; Package Size: 0.126" L x 0.051" W (3.20mm x 1.30mm)

## Sheet POWER STAGE.SchDoc: POWER
size A3; DocumentNumber: 5; SheetNumber: 5; SheetTotal: 6
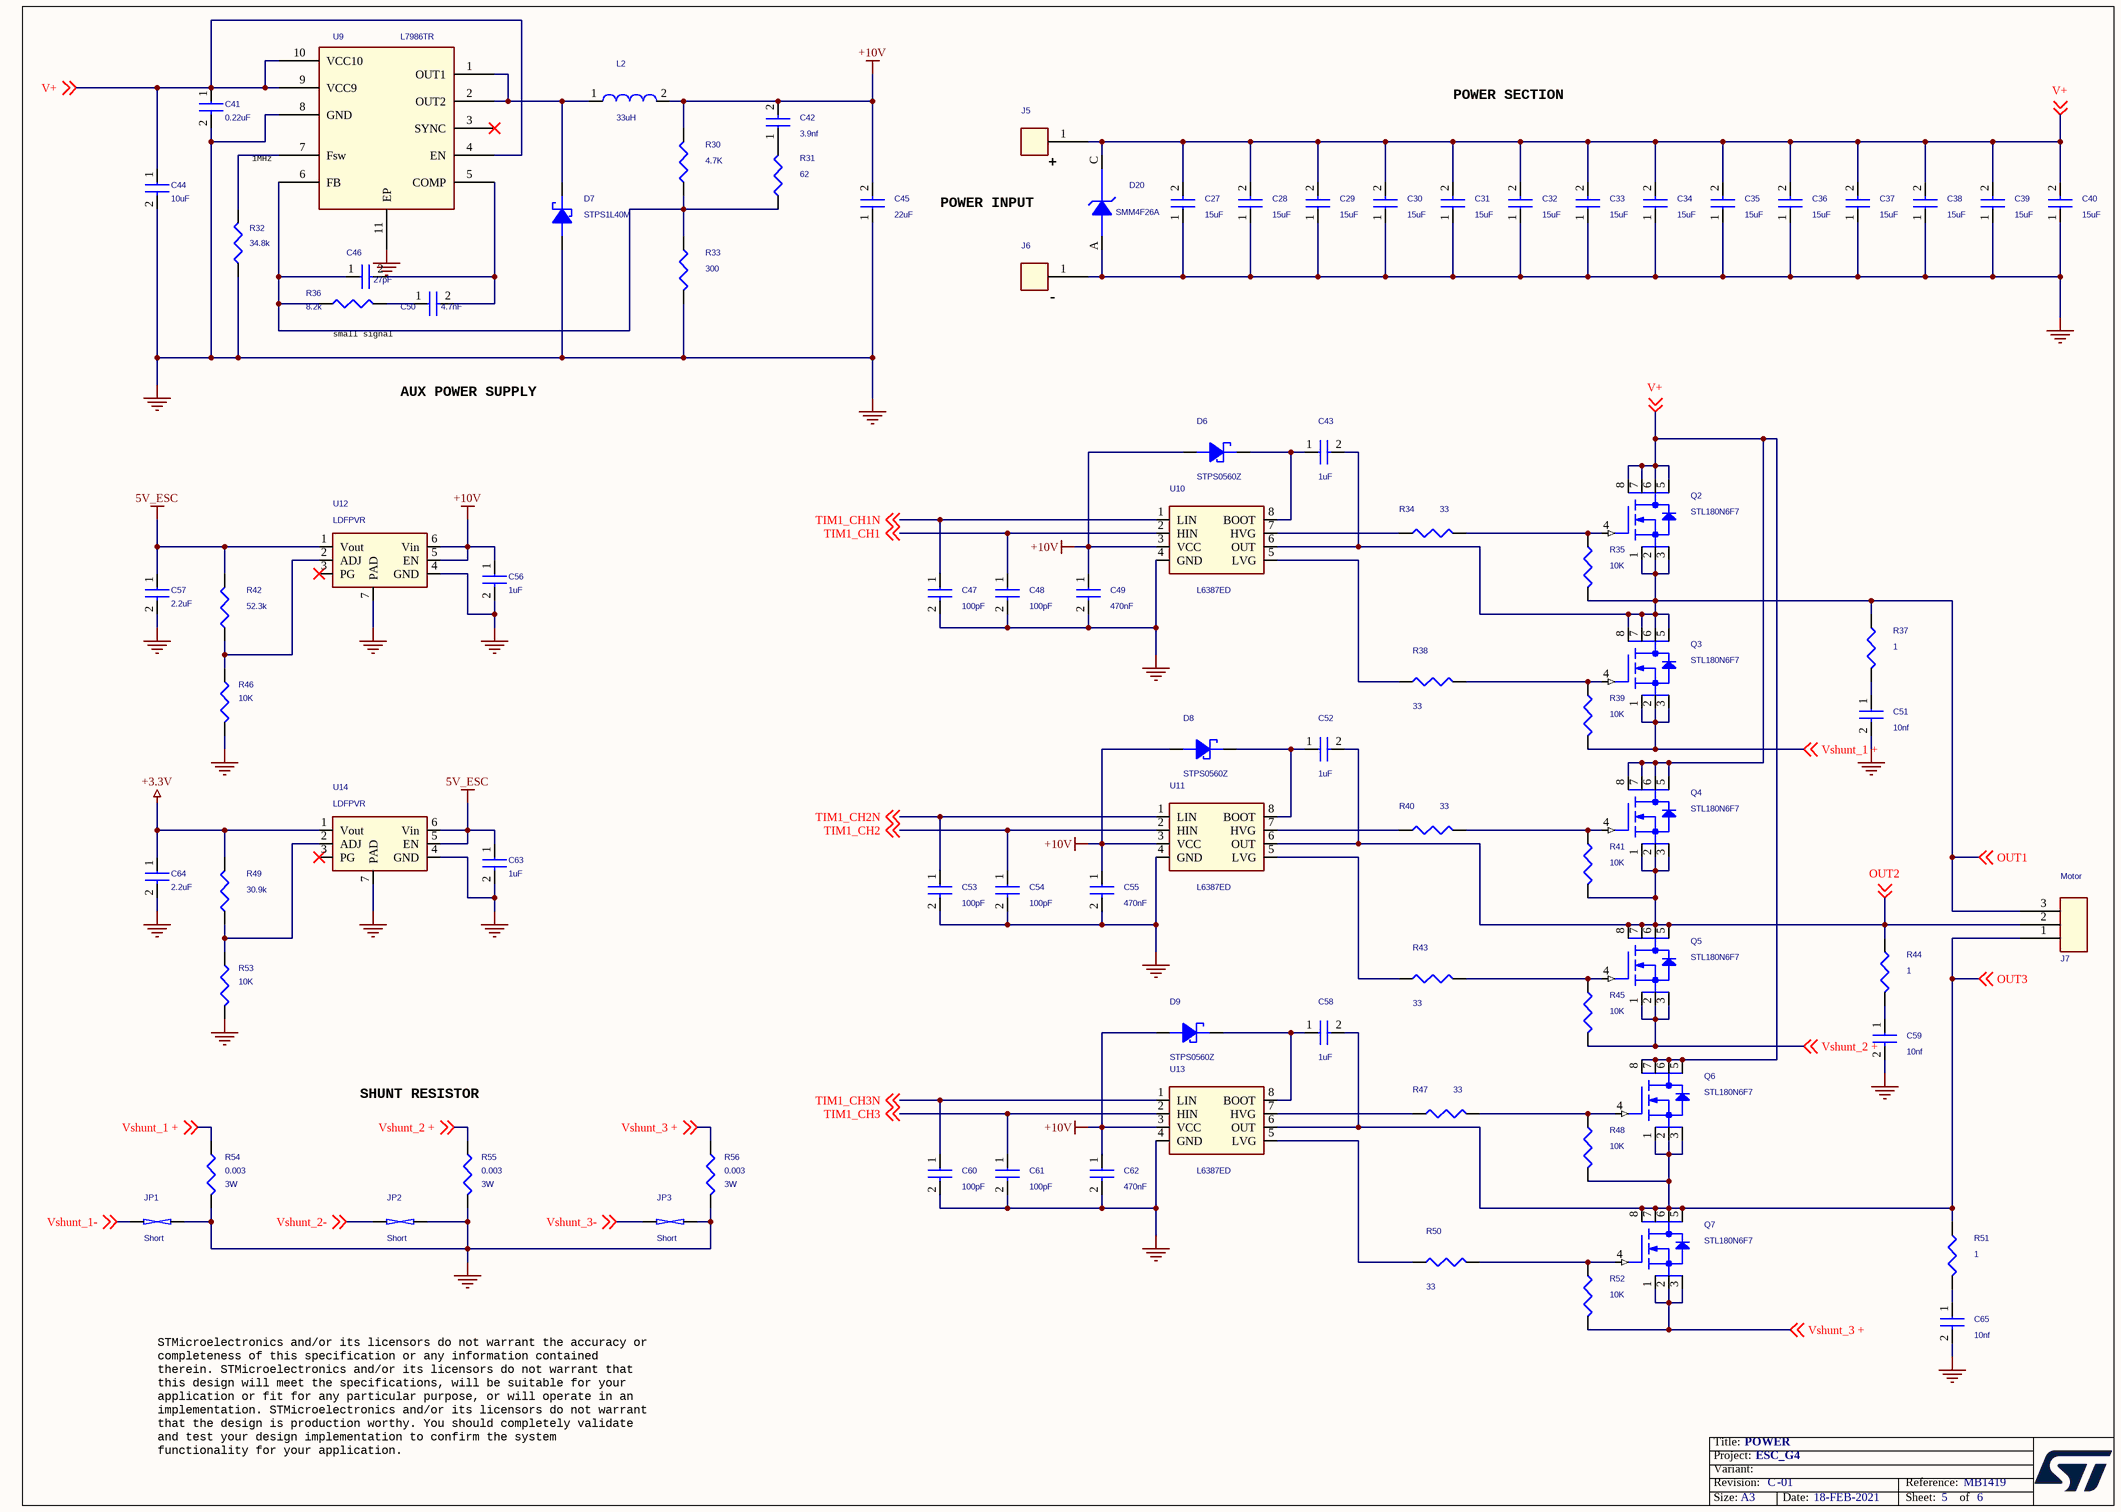
[diagram p5: POWER STAGE.SchDoc]

### Parts
C27  15uF  [C_0805_HD]
C28  15uF  [C_0805_HD]
C29  15uF  [C_0805_HD]
C30  15uF  [C_0805_HD]
C31  15uF  [C_0805_HD]
C32  15uF  [C_0805_HD]
C33  15uF  [C_0805_HD]
C34  15uF  [C_0805_HD]
C35  15uF  [C_0805_HD]
C36  15uF  [C_0805_HD]
C37  15uF  [C_0805_HD]
C38  15uF  [C_0805_HD]
C39  15uF  [C_0805_HD]
C40  15uF  [C_0805_HD]
C41  0.22uF  [C_0603_HD]
C42  3.9nf  [C_0402]
C43  1uF  [C_0603_HD]
C44  10uF  [C_1206]
C45  22uF  [C_1206]
C46  27pF  [C_0402]
C47  100pF  [C_0402]
C48  100pF  [C_0402]
C49  470nF  [C_0603_HD]
C50  4.7nF  [C_0402]
C51  10nf  [C_0603]
C52  1uF  [C_0603_HD]
C53  100pF  [C_0402]
C54  100pF  [C_0402]
C55  470nF  [C_0603_HD]
C56  1uF  [C_0402]
C57  2.2uF  [C_0402]
C58  1uF  [C_0603_HD]
C59  10nf  [C_0603]
C60  100pF  [C_0402]
C61  100pF  [C_0402]
C62  470nF  [C_0603_HD]
C63  1uF  [C_0402]
C64  2.2uF  [C_0402]
C65  10nf  [C_0603]
D6  STPS0560Z  [SOD_123]
D7  STPS1L40M  [do216-aa_stmite]
D8  STPS0560Z  [SOD_123]
D9  STPS0560Z  [SOD_123]
D20  SMM4F26A  [do216-aa-flat]
J5  CON1  [wire1_220s]  (value not drawn)
J6  CON1  [wire1_220s]  (value not drawn)
J7  Motor  [conn_motor_out]
JP1  Short  [SHORT]
JP2  Short  [SHORT]
JP3  Short  [SHORT]
L2  33uH  [ind_Coilcraft-LPS4018]
Q2  STL180N6F7  [power_flat_5x6]
Q3  STL180N6F7  [power_flat_5x6]
Q4  STL180N6F7  [power_flat_5x6]
Q5  STL180N6F7  [power_flat_5x6]
Q6  STL180N6F7  [power_flat_5x6]
Q7  STL180N6F7  [power_flat_5x6]
R30  4.7K  [R_0402]
R31  62  [R_0402]
R32  34.8k  [R_0402]
R33  300  [R_0402]
R34  33  [R_0603_HD]
R35  10K  [R_0402]
R36  8.2k  [R_0402]
R37  1  [R_0805]
R38  33  [R_0603_HD]
R39  10K  [R_0402]
R40  33  [R_0603_HD]
R41  10K  [R_0402]
R42  52.3k  [R_0402]
R43  33  [R_0603_HD]
R44  1  [R_0805]
R45  10K  [R_0402]
R46  10K  [R_0402]
R47  33  [R_0603_HD]
R48  10K  [R_0402]
R49  30.9k  [R_0402]
R50  33  [R_0603_HD]
R51  1  [R_0805]
R52  10K  [R_0402]
R53  10K  [R_0402]
R54  0.003  Rated Power: 3W  [resc635x300x60l193n]
R55  0.003  Rated Power: 3W  [resc635x300x60l193n]
R56  0.003  Rated Power: 3W  [resc635x300x60l193n]
U9  L7986TR  [son11p50_300x300x100l40x24t2-1]
U10  L6387ED  [SOIC8P127_490X600X175L83X42N]
U11  L6387ED  [SOIC8P127_490X600X175L83X42N]
U12  LDFPVR  [son7p65_200x200x100l25x30t18-1]
U13  L6387ED  [SOIC8P127_490X600X175L83X42N]
U14  LDFPVR  [son7p65_200x200x100l25x30t18-1]

### Nets
5V_ESC: C57.1 C63.1 R42.2 U12.1(Vout) U14.5(EN) U14.6(Vin)
+3.3V: C64.1 R49.2 U14.1(Vout)
+10V: C42.2 C45.2 C49.1 C55.1 C56.1 C62.1 D6.A D8.A D9.A L2.2 R30.1 U10.3(VCC) U11.3(VCC) U12.5(EN) U12.6(Vin) U13.3(VCC)
GND: C27.1 C28.1 C29.1 C30.1 C31.1 C32.1 C33.1 C34.1 C35.1 C36.1 C37.1 C38.1 C39.1 C40.1 C41.2 C44.2 C45.1 C47.2 C48.2 C49.2 C51.2 C53.2 C54.2 C55.2 C56.2 C57.2 C59.2 C60.2 C61.2 C62.2 C63.2 C64.2 C65.2 D7.A D20.A J6.1 JP1.2 JP2.2 JP3.2 R32.2 R33.1 R46.2 R53.2 R54.2 R55.2 R56.2 U9.8(GND) U9.11(EP) U10.4(GND) U11.4(GND) U12.4(GND) U12.7(PAD) U13.4(GND) U14.4(GND) U14.7(PAD)
OUT1: C43.2 J7.3 Q2.1(S1) Q2.2(S2) Q2.3(S3) Q3.5(D) Q3.6(D6) Q3.7(D7) Q3.8(D8) R35.2 R37.1 U10.6(OUT) ; off-sheet OUT1
OUT2: C52.2 J7.2 Q4.1(S1) Q4.2(S2) Q4.3(S3) Q5.5(D) Q5.6(D6) Q5.7(D7) Q5.8(D8) R41.2 R44.1 U11.6(OUT) ; off-sheet OUT2
OUT3: C58.2 J7.1 Q6.1(S1) Q6.2(S2) Q6.3(S3) Q7.5(D) Q7.6(D6) Q7.7(D7) Q7.8(D8) R48.2 R51.1 U13.6(OUT) ; off-sheet OUT3
TIM1_CH1: C48.1 U10.2(HIN) ; off-sheet TIM1_CH1  [project net UH]
TIM1_CH1N: C47.1 U10.1(LIN) ; off-sheet TIM1_CH1N  [project net PC13-UL]
TIM1_CH2: C54.1 U11.2(HIN) ; off-sheet TIM1_CH2  [project net VH]
TIM1_CH2N: C53.1 U11.1(LIN) ; off-sheet TIM1_CH2N  [project net VL]
TIM1_CH3: C61.1 U13.2(HIN) ; off-sheet TIM1_CH3  [project net WH]
TIM1_CH3N: C60.1 U13.1(LIN) ; off-sheet TIM1_CH3N  [project net WL]
V+: C27.2 C28.2 C29.2 C30.2 C31.2 C32.2 C33.2 C34.2 C35.2 C36.2 C37.2 C38.2 C39.2 C40.2 C41.1 C44.1 D20.C J5.1 Q2.5(D) Q2.6(D6) Q2.7(D7) Q2.8(D8) Q4.5(D) Q4.6(D6) Q4.7(D7) Q4.8(D8) Q6.5(D) Q6.6(D6) Q6.7(D7) Q6.8(D8) U9.4(EN) U9.9(VCC9) U9.10(VCC10) ; off-sheet V+
Vshunt_1 +: Q3.1(S1) Q3.2(S2) Q3.3(S3) R39.2 R54.1 ; off-sheet Vshunt_1 +
Vshunt_1-: JP1.1 ; off-sheet Vshunt_1-  [project net Curr_fdbk1_OPAmp-]
Vshunt_2 +: Q5.1(S1) Q5.2(S2) Q5.3(S3) R45.2 R55.1 ; off-sheet Vshunt_2 +
Vshunt_2-: JP2.1 ; off-sheet Vshunt_2-  [project net Curr_fdbk2_OPAmp-]
Vshunt_3 +: Q7.1(S1) Q7.2(S2) Q7.3(S3) R52.2 R56.1 ; off-sheet Vshunt_3 +
Vshunt_3-: JP3.1 ; off-sheet Vshunt_3-  [project net Curr_fdbk3_OPAmp-]
NetC42_1: C42.1 R31.1
NetC43_1: C43.1 D6.C U10.8(BOOT)
NetC46_1: C46.1 R30.2 R31.2 R33.2 R36.2 U9.6(FB)
NetC46_2: C46.2 C50.2 U9.5(COMP)
NetC50_1: C50.1 R36.1
NetC51_1: C51.1 R37.2
NetC52_1: C52.1 D8.C U11.8(BOOT)
NetC58_1: C58.1 D9.C U13.8(BOOT)
NetC59_1: C59.1 R44.2
NetC65_1: C65.1 R51.2
NetD7_C: D7.C L2.1 U9.1(OUT1) U9.2(OUT2)
NetQ2_4: Q2.4(G) R34.2 R35.1
NetQ3_4: Q3.4(G) R38.2 R39.1
NetQ4_4: Q4.4(G) R40.2 R41.1
NetQ5_4: Q5.4(G) R43.2 R45.1
NetQ6_4: Q6.4(G) R47.2 R48.1
NetQ7_4: Q7.4(G) R50.2 R52.1
NetR32_1: R32.1 U9.7(Fsw)
NetR34_1: R34.1 U10.7(HVG)
NetR38_1: R38.1 U10.5(LVG)
NetR40_1: R40.1 U11.7(HVG)
NetR42_1: R42.1 R46.1 U12.2(ADJ)
NetR43_1: R43.1 U11.5(LVG)
NetR47_1: R47.1 U13.7(HVG)
NetR49_1: R49.1 R53.1 U14.2(ADJ)
NetR50_1: R50.1 U13.5(LVG)

Not connected (* = marked no-connect by the designer): U9 3(SYNC)*; U12 3(PG)*; U14 3(PG)*

### Notes on the sheet
- POWER SECTION
- 1MHz
- (near J5) +
- POWER INPUT
- (near J6) -
- (near R36) small signal
- AUX POWER SUPPLY
- (near R55) SHUNT RESISTOR
- STMicroelectronics and/or its licensors do not warrant the accuracy or
  completeness of this specification or any information contained
  therein. STMicroelectronics and/or its licensors do not warrant that
  this design will meet the specifications, will be suitable for your
  application or fit for any particular purpose, or will operate in an
  implementation. STMicroelectronics and/or its licensors do not warrant
  that the design is production worthy. You should completely validate
  and test your design implementation to confirm the system
  functionality for your application.
- Title:
- Project:
- Size:
- Revision:
- Variant:
- A3
- Date:
- Reference:
- Sheet:
- of

### Library data of the parts
C27-C40 = CAP_Dup1: CAP CER 15UF 35V X5R 0805; PART_NUMBER: TMP-773; Manufacturer: TDK Corporation; Manufacturer PN: C2012X5R1V156M125AC; Dielectric Type: Capacitors; Tolerance: 20%; CLASS: DISCRETE; ALT_SYMBOLS: C_0805_hd; Package Size: 0805 (2012 Metric); Temperature Coefficient: X5R; Rated Voltage: 35V
C41 = CAP_Dup1: CAP CER 0.22UF 50V X7R 0603; Manufacturer PN: CGA3E3X7R1H224K080AD; Manufacturer: TDK Corporation; PART_NUMBER: TMP-138; CLASS: DISCRETE; Tolerance: 10%; Dielectric Type: Capacitors; Rated Voltage: 50V; Temperature Coefficient: X7R; Package Size: 0603 (1608 Metric); ALT_SYMBOLS: c_0603_hd
C42 = CAP_Dup1: CAP CER 3900PF 16V X7R 0402; Manufacturer PN: C0402C392K4RAC7867; Manufacturer: KEMET; PART_NUMBER: TMP-419; CLASS: DISCRETE; Tolerance: 10%; Dielectric Type: Capacitors; Rated Voltage: 16V; Temperature Coefficient: X7R; Package Size: 0402 (1005 Metric)
C43 C52 C58 = CAP_Dup1: CAP CER 1UF 25V X7R 0603; PART_NUMBER: TMP-446; Manufacturer: Wurth Electronics Inc.; Manufacturer PN: 885012206076; Dielectric Type: Capacitors; Tolerance: 10%; CLASS: DISCRETE; ALT_SYMBOLS: c_0603_hd; Package Size: 0603 (1608 Metric); Temperature Coefficient: X7R; Rated Voltage: 25V
C44 = CAP_Dup1: CAP CER 10UF 50V X7R 1206; Manufacturer PN: CL31B106KBHNNNE; Manufacturer: Samsung Electro-Mechanics America, Inc.; PART_NUMBER: CAP-00000016; CLASS: DISCRETE; Tolerance: 10%; Dielectric Type: Capacitors; Rated Voltage: 50V; Temperature Coefficient: X7R; Package Size: 1206 (3216 Metric)
C45 = CAP_Dup1: CAP CER 22UF 25V X5R 1206; Manufacturer PN: CL31A226KAHNNNE; Manufacturer: Samsung Electro-Mechanics; PART_NUMBER: TMP-421; CLASS: DISCRETE; Tolerance: 20%; Dielectric Type: Capacitors; Rated Voltage: 25V; Temperature Coefficient: X5R; Package Size: 1206 (3216 Metric)
C46 = CAP_Dup1: CAP CER 27PF 25V C0G/NP0 0402; Manufacturer PN: CC0402JRNPO9BN270; Manufacturer: YAGEO; PART_NUMBER: TMP-416; CLASS: DISCRETE; Tolerance: 5%; Temperature Coefficient: C0G, NP0; Dielectric Type: Capacitors; Rated Voltage: 25V; Package Size: 0402 (1005 Metric)
C47 C48 C53 C54 C60 C61 = CAP_Dup1: CAP CER 100PF 25V X7R 0402; PART_NUMBER: TMP-426; Manufacturer: Wurth Electronics Inc.; Manufacturer PN: 885012205038; Dielectric Type: Capacitors; Tolerance: 10%; CLASS: DISCRETE; Package Size: 0402 (1005 Metric); Temperature Coefficient: X7R; Rated Voltage: 25V
C49 C55 C62 = CAP_Dup1: CAP CER 0.47UF 25V X7R 0603; PART_NUMBER: TMP-428; Manufacturer: Wurth Electronics Inc.; Manufacturer PN: 885012206075; Dielectric Type: Capacitors; Tolerance: 10%; CLASS: DISCRETE; ALT_SYMBOLS: c_0603_hd; Package Size: 0603 (1608 Metric); Temperature Coefficient: X7R; Rated Voltage: 25V
C50 = CAP_Dup1: CAP CER 4700PF 16V X7R 0402; Manufacturer PN: 885012205029; Manufacturer: Wurth Electronics Inc.; PART_NUMBER: TMP-417; CLASS: DISCRETE; Tolerance: 10%; Dielectric Type: Capacitors; Rated Voltage: 16V; Temperature Coefficient: X7R; Package Size: 0402 (1005 Metric)
C51 C59 C65 = CAP_Dup1: CAP CER 10000PF 100V X7R 0603; PART_NUMBER: CAP-00000040; Manufacturer: YAGEO; Manufacturer PN: CC0603KRX7R0BB103; Dielectric Type: Capacitors; Tolerance: 20%; CLASS: DISCRETE; Package Size: 0603 (1608 Metric); Temperature Coefficient: X7R; Rated Voltage: 100V
C56 C63 = CAP_Dup1: CAP CER 1UF 25V X5R 0402; Manufacturer PN: GRM155R61E105KA12D; Manufacturer: Murata Electronics North America; PART_NUMBER: CAP-00000006; CLASS: DISCRETE; Tolerance: 10%; Dielectric Type: Capacitors; Rated Voltage: 25V; Temperature Coefficient: X5R; Package Size: 0402 (1005 Metric)
C57 C64 = CAP_Dup1: CAP CER 2.2UF 10V X5R 0402; PART_NUMBER: TMP-449; Manufacturer: Wurth Electronics Inc.; Manufacturer PN: 885012105013; Dielectric Type: Capacitors; Tolerance: 20%; CLASS: DISCRETE; Package Size: 0402 (1005 Metric); Temperature Coefficient: X5R; Rated Voltage: 10V
D6 D8 D9 = DIODE_SCHOTTKY_0: DIODE SCHOTTKY 60V 500MA SOD123; Manufacturer: STMicroelectronics; PART_NUMBER: TMP-373; CLASS: DISCRETE; Rated Voltage: 530mV @ 500mA; Manufacturer PN: STPS0560Z; Package Size: SOD-123
D7 = DIODE_SCHOTTKY_0: DIODE SCHOTTKY 40V 1A STMITE; PART_NUMBER: TMP-372; Manufacturer: STMicroelectronics; Rated Voltage: 460mV @ 1A; CLASS: DISCRETE; Package Size: DO-216AA; Manufacturer PN: STPS1L40M
D20 = DIODE_TRANSIL_UNI_0: TVS DIODE 26VWM 53.5VC DO222AA; Manufacturer PN: SMM4F26A-TR; Manufacturer: STMicroelectronics; PART_NUMBER: TMP-376; CLASS: DISCRETE; Package Size: DO-216AA FLAT
J5 J6 = CON1: SOLDER PADS
J7 = CON3: SOLDER PADS
JP1-JP3 = SHORT: 2 PIN SHORTED TO CONNECT DIFFERENT NETS; PART_NUMBER: TMP-442; CLASS: DISCRETE
L2 = IND: Fixed Inductors LPS4018 Low Profile 33uH 0.8A 20% SMD; Manufacturer PN: LPS4018-333MRB; Manufacturer: Coilcraft; PART_NUMBER: TMP-377; CLASS: DISCRETE; Tolerance: 20%; Package Size: 3.9x3.9x1.7
Q2-Q7 = MOSFET_N_DIODE_SSSGDDDD: N-channel 60 V, 1.9 mO typ., 120 A STripFET™ F7; PART_NUMBER: TMP-772; Manufacturer: STMicroelectronics; CLASS: DISCRETE; Rated Voltage: 60V; Package Size: PowerFLAT 5x6; Manufacturer PN: STL180N6F7
R30 = RES: RES SMD 4.7K OHM 1% 1/16W 0402; Manufacturer PN: CRG0402F4K7; Manufacturer: TE Connectivity Passive Product; PART_NUMBER: TMP-403; CLASS: DISCRETE; Rated Power: 0.063W, 1/16W; Temperature Coefficient: 100ppm/C; Tolerance: 1%; Package Size: 0402 (1005 Metric)
R31 = RES: RES SMD 62 OHM 1% 1/16W 0402; Manufacturer PN: RC0402FR-0762RL; Manufacturer: Yageo; PART_NUMBER: TMP-420; CLASS: DISCRETE; Rated Power: 0.063W, 1/16W; Temperature Coefficient: 100ppm/C; Tolerance: 1%; Package Size: 0402 (1005 Metric)
R32 = RES: RES SMD 34.8K OHM 1% 1/16W 0402; Manufacturer PN: RC0402FR-0734K8L; Manufacturer: Yageo; PART_NUMBER: TMP-415; CLASS: DISCRETE; Rated Power: 0.063W, 1/16W; Temperature Coefficient: 100ppm/C; Tolerance: 1%; Package Size: 0402 (1005 Metric)
R33 = RES: RES SMD 300 OHM 1% 1/16W 0402; PART_NUMBER: TMP-418; Manufacturer: Yageo; Manufacturer PN: RC0402FR-07300RL; Temperature Coefficient: 100ppm/C; Rated Power: 0.063W, 1/16W; CLASS: DISCRETE; Package Size: 0402 (1005 Metric); Tolerance: 1%
R34 R40 = RES: RES SMD 33 OHM 1% 1/10W 0603; Manufacturer PN: 9C06031A33R0FKHFT; Manufacturer: Yageo; PART_NUMBER: TMP-266; CLASS: DISCRETE; Rated Power: 0.1W, 1/10W; Temperature Coefficient: 100ppm/C; ALT_SYMBOLS: r_0603_hd; Tolerance: 1%; Package Size: 0603 (1608 Metric)
R35 R39 R41 R45 = RES: as R3 on sheet DAUGHTERBOARD; Tolerance: 1%; Package Size: 0402 (1005 Metric)
R36 = RES: RES SMD 8.2K OHM 5% 1/16W 0402; Manufacturer PN: RC0402JR-078K2L; Manufacturer: Yageo; PART_NUMBER: RES-00000047; CLASS: DISCRETE; Rated Power: 0.063W, 1/16W; Temperature Coefficient: 100ppm/C; Tolerance: 5%; Package Size: 0402 (1005 Metric)
R37 R44 R51 = RES: RES SMD 1 OHM 5% 1/8W 0805; PART_NUMBER: TMP-430; Manufacturer: Panasonic Electronic Components; Manufacturer PN: ERJ-6GEYJ1R0V; Temperature Coefficient: -100/ +600ppm/C; Rated Power: 0.125W, 1/8W; CLASS: DISCRETE; Package Size: 0805 (2012 Metric); Tolerance: 5%
R38 R43 R47 R50 = RES: RES SMD 33 OHM 1% 1/10W 0603; PART_NUMBER: TMP-266; Manufacturer: Yageo; Manufacturer PN: 9C06031A33R0FKHFT; Temperature Coefficient: 100ppm/C; Rated Power: 0.1W, 1/10W; CLASS: DISCRETE; ALT_SYMBOLS: r_0603_hd; Package Size: 0603 (1608 Metric); Tolerance: 1%
R42 = RES: RES SMD 52.3K OHM 1% 1/16W 0402; Manufacturer PN: RC1005F5232CS; Manufacturer: Samsung Electro-Mechanics; PART_NUMBER: TMP-447; CLASS: DISCRETE; Rated Power: 0.063W, 1/16W; Temperature Coefficient: 100ppm/C; Tolerance: 1%; Package Size: 0402 (1005 Metric)
R46 = RES: RES SMD 10K OHM 1% 1/16W 0402; PART_NUMBER: TMP-396; Manufacturer: Yageo; Manufacturer PN: RC0402FR-0710KL; CLASS: DISCRETE; Rated Power: 0.063W, 1/16W; Temperature Coefficient: 100ppm/C; Package Size: 0402 (1005 Metric); Tolerance: 1%
R48 R52 R53 = RES: as R10 on sheet DAUGHTERBOARD; Package Size: 0402 (1005 Metric); Tolerance: 1%
R49 = RES: RES SMD 30.9K OHM 1% 1/10W 0402; PART_NUMBER: TMP-448; Manufacturer: Panasonic Electronic Components; Manufacturer PN: ERJ-2RKF3092X; Temperature Coefficient: 100ppm/C; Rated Power: 0.1W, 1/10W; CLASS: DISCRETE; Package Size: 0402 (1005 Metric); Tolerance: 1%
R54 R56 = RES: RES 0.003 OHM 1% 3W 2512; PART_NUMBER: TMP-766; Manufacturer: ROHM; Manufacturer PN: PSR100KTQFL3L00; Temperature Coefficient: 50ppm/C; CLASS: DISCRETE; Package Size: 2512 (6432 Metric); Tolerance: 1%
R55 = RES: RES 0.003 OHM 1% 3W 2512; Manufacturer PN: PSR100KTQFL3L00; Manufacturer: ROHM; PART_NUMBER: TMP-766; CLASS: DISCRETE; Temperature Coefficient: 50ppm/C; Tolerance: 1%; Package Size: 2512 (6432 Metric)
U9 = L7986TR: IC REG BUCK ADJ 3A 10VDFPN; Manufacturer: STMicroelectronics; PART_NUMBER: TMP-362; Manufacturer PN: L7986TR; CLASS: IC; Package Size: 10-VFDFN Exposed Pad
U10 = L6387E: IC DRIVER HI/LO SIDE HV 8-SOIC; Manufacturer: STMicroelectronics; PART_NUMBER: TMP-367; Supply Voltage: 17V (Max); Manufacturer PN: L6387ED; CLASS: IC; Package Size: 8-SOIC (0.154", 3.90mm Width)
U11 U13 = L6387E: IC DRIVER HI/LO SIDE HV 8-SOIC; PART_NUMBER: TMP-367; Manufacturer: STMicroelectronics; Supply Voltage: 17V (Max); Package Size: 8-SOIC (0.154", 3.90mm Width); CLASS: IC; Manufacturer PN: L6387ED
U12 = LDFPxR: IC REG LINEAR POS ADJ 1A 6DFN; PART_NUMBER: TMP-450; Manufacturer: STMicroelectronics; Package Size: 6-VDFN Exposed Pad; CLASS: IC; Manufacturer PN: LDFPVR
U14 = LDFPxR: IC REG LINEAR POS ADJ 1A 6DFN; Manufacturer: STMicroelectronics; PART_NUMBER: TMP-450; Manufacturer PN: LDFPVR; CLASS: IC; Package Size: 6-VDFN Exposed Pad

## Sheet SENSING.SchDoc: SENSING
size A3; DocumentNumber: 6; SheetNumber: 6; SheetTotal: 6
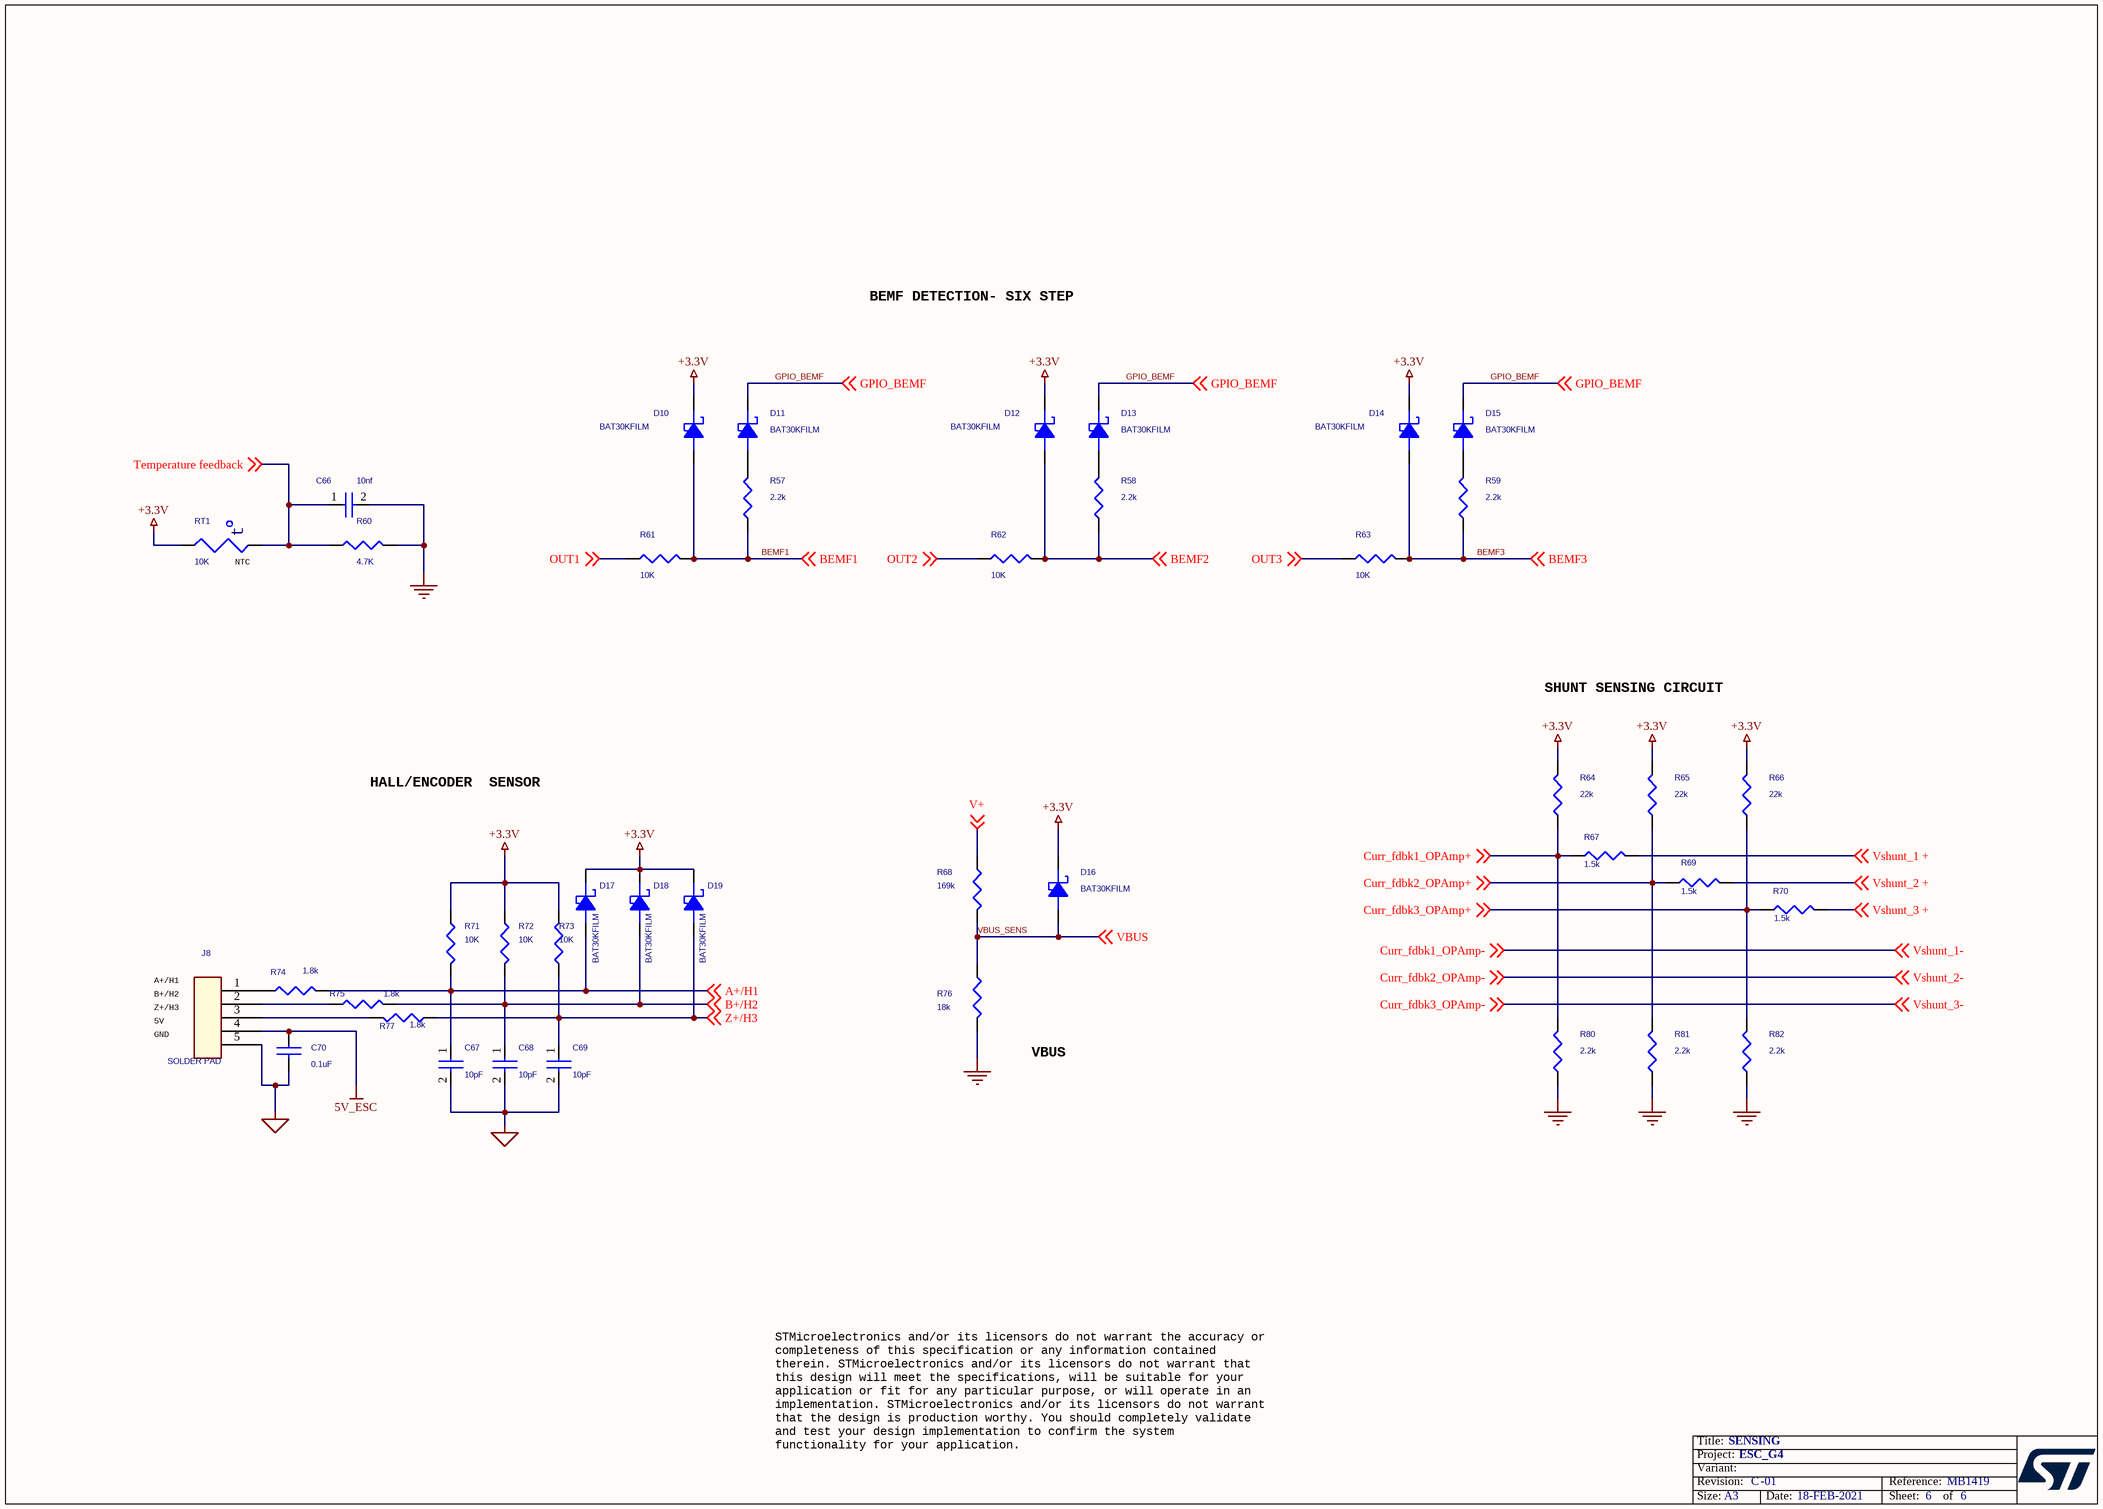
[diagram p6: SENSING.SchDoc]

### Parts
C66  10nf  [C_0402]
C67  10pF  [C_0402]
C68  10pF  [C_0402]
C69  10pF  [C_0402]
C70  0.1uF  [C_0402]
D10  BAT30KFILM  [sodfl160x80x65l30x30n]
D11  BAT30KFILM  [sodfl160x80x65l30x30n]
D12  BAT30KFILM  [sodfl160x80x65l30x30n]
D13  BAT30KFILM  [sodfl160x80x65l30x30n]
D14  BAT30KFILM  [sodfl160x80x65l30x30n]
D15  BAT30KFILM  [sodfl160x80x65l30x30n]
D16  BAT30KFILM  [sodfl160x80x65l30x30n]
D17  BAT30KFILM  [sodfl160x80x65l30x30n]
D18  BAT30KFILM  [sodfl160x80x65l30x30n]
D19  BAT30KFILM  [sodfl160x80x65l30x30n]
J8  SOLDER PAD  [SOLDER_PAD_5PIN_SMD]
R57  2.2k  [R_0402]
R58  2.2k  [R_0402]
R59  2.2k  [R_0402]
R60  4.7K  [R_0402]
R61  10K  [R_0603_HD]
R62  10K  [R_0603_HD]
R63  10K  [R_0603]
R64  22k  [r_0402]
R65  22k  [r_0402]
R66  22k  [r_0402]
R67  1.5k  [R_0402]
R68  169k  [R_0402]
R69  1.5k  [R_0402]
R70  1.5k  [R_0402]
R71  10K  [R_0402]
R72  10K  [R_0402]
R73  10K  [R_0402]
R74  1.8k  [R_0402]
R75  1.8k  [R_0402]
R76  18k  [R_0402]
R77  1.8k  [R_0402]
R80  2.2k  [R_0402]
R81  2.2k  [R_0402]
R82  2.2k  [R_0402]
RT1  10K  [R_0402]

### Nets
5V_ESC: C70.1 J8.4
+3.3V: D10.C D12.C D14.C D16.C D17.C D18.C D19.C R64.2 R65.2 R66.2 R71.1 R72.1 R73.2 RT1.1
GND: C66.2 C67.2 C68.2 C69.2 C70.2 J8.5 R60.2 R76.2 R80.1 R81.1 R82.1  [also labelled GND_SIGNAL]
A+/H1: C67.1 D17.A R71.2 R74.2 ; off-sheet A+/H1
B+/H2: C68.1 D18.A R72.2 R75.2 ; off-sheet B+/H2
BEMF1: D10.A R57.1 R61.2 ; off-sheet BEMF1
BEMF2: D12.A R58.1 R62.2 ; off-sheet BEMF2
BEMF3: D14.A R59.1 R63.2 ; off-sheet BEMF3
Curr_fdbk1_OPAmp+: R64.1 R67.1 R80.2 ; off-sheet Curr_fdbk1_OPAmp+
Curr_fdbk1_OPAmp-: off-sheet Curr_fdbk1_OPAmp-, off-sheet Vshunt_1-  [also labelled Vshunt_1-]
Curr_fdbk2_OPAmp+: R65.1 R69.1 R81.2 ; off-sheet Curr_fdbk2_OPAmp+
Curr_fdbk2_OPAmp-: off-sheet Curr_fdbk2_OPAmp-, off-sheet Vshunt_2-  [also labelled Vshunt_2-]
Curr_fdbk3_OPAmp+: R66.1 R70.1 R82.2 ; off-sheet Curr_fdbk3_OPAmp+
Curr_fdbk3_OPAmp-: off-sheet Curr_fdbk3_OPAmp-, off-sheet Vshunt_3-  [also labelled Vshunt_3-]
GPIO_BEMF: D11.C D13.C D15.C ; off-sheet GPIO_BEMF
OUT1: R61.1 ; off-sheet OUT1
OUT2: R62.1 ; off-sheet OUT2
OUT3: R63.1 ; off-sheet OUT3
Temperature feedback: C66.1 R60.1 RT1.2 ; off-sheet Temperature feedback
V+: R68.1 ; off-sheet V+
VBUS: D16.A R68.2 R76.1 ; off-sheet VBUS  [also labelled VBUS_SENS]  [project net PA0 - BUSV]
Vshunt_1 +: R67.2 ; off-sheet Vshunt_1 +
Vshunt_2 +: R69.2 ; off-sheet Vshunt_2 +
Vshunt_3 +: R70.2 ; off-sheet Vshunt_3 +
Z+/H3: C69.1 D19.A R73.1 R77.1 ; off-sheet Z+/H3
NetD11_A: D11.A R57.2
NetD13_A: D13.A R58.2
NetD15_A: D15.A R59.2
NetJ8_1: J8.1 R74.1
NetJ8_2: J8.2 R75.1
NetJ8_3: J8.3 R77.2

### Notes on the sheet
- BEMF DETECTION- SIX STEP
- (near RT1) NTC
- SHUNT SENSING CIRCUIT
- HALL/ENCODER  SENSOR
- (near J8) A+/H1
- 5V
- (near J8) Z+/H3
- (near J8) B+/H2
- GND
- VBUS
- STMicroelectronics and/or its licensors do not warrant the accuracy or
  completeness of this specification or any information contained
  therein. STMicroelectronics and/or its licensors do not warrant that
  this design will meet the specifications, will be suitable for your
  application or fit for any particular purpose, or will operate in an
  implementation. STMicroelectronics and/or its licensors do not warrant
  that the design is production worthy. You should completely validate
  and test your design implementation to confirm the system
  functionality for your application.
- Title:
- Project:
- Size:
- Revision:
- Variant:
- A3
- -
- Date:
- Reference:
- Sheet:
- of
- (in symbol NTC) t

### Library data of the parts
C66 = CAP_Dup1: CAP CER 10000PF 10V X7R 0402; PART_NUMBER: CAP-00000003; Manufacturer: Wurth Electronics Inc.; Manufacturer PN: 885012205012; Dielectric Type: Capacitors; Tolerance: 10%; CLASS: DISCRETE; Package Size: 0402 (1005 Metric); Temperature Coefficient: X7R; Rated Voltage: 10V
C67-C69 = CAP: CAP CER 10PF 10V C0G/NP0 0402; Manufacturer PN: 885012005007; Manufacturer: Wurth Electronics Inc.; PART_NUMBER: TMP-395; CLASS: DISCRETE; Tolerance: 5%; Temperature Coefficient: C0G, NP0; Dielectric Type: Capacitors; Rated Voltage: 10V; Package Size: 0402 (1005 Metric)
C70 = CAP_4: CAP CER 0.1UF 16V X7R 0402; Manufacturer PN: 885012205037; Manufacturer: Wurth Electronics Inc.; PART_NUMBER: CAP-00000053; CLASS: DISCRETE; Tolerance: 10%; Dielectric Type: Capacitors; Rated Voltage: 16V; Temperature Coefficient: X7R; Package Size: 0402 (1005 Metric)
D10 D17 D19 = DIODE_SCHOTTKY_0: DIODE SCHOTTKY 30V 300MA SOD523; Manufacturer: STMicroelectronics; PART_NUMBER: TMP-46; CLASS: DISCRETE; Rated Voltage: 530mV @ 300mA; Manufacturer PN: BAT30KFILM; Package Size: SC-79, SOD-523
D11-D16 D18 = DIODE_SCHOTTKY_0: DIODE SCHOTTKY 30V 300MA SOD523; PART_NUMBER: TMP-46; Manufacturer: STMicroelectronics; Rated Voltage: 530mV @ 300mA; CLASS: DISCRETE; Package Size: SC-79, SOD-523; Manufacturer PN: BAT30KFILM
J8 = CON5: SOLDER PADS
R57-R59 = RES: RES SMD 2.2K OHM 1% 1/16W 0402; Manufacturer PN: RC0402FR-072K2L; Manufacturer: Yageo; PART_NUMBER: TMP-444; CLASS: DISCRETE; Rated Power: 0.063W, 1/16W; Temperature Coefficient: 100ppm/C; Tolerance: 1%; Package Size: 0402 (1005 Metric)
R60 = RES: as R19 on sheet DAUGHTERBOARD; Package Size: 0402 (1005 Metric); Tolerance: 1%
R61 R62 = RES: RES SMD 10K OHM 1% 1/10W 0603; PART_NUMBER: RES-00000015; Manufacturer: Yageo; Manufacturer PN: RC0603FR-0710KL; Temperature Coefficient: 100ppm/C; Rated Power: 0.1W, 1/10W; CLASS: DISCRETE; ALT_SYMBOLS: r_0603_hd; Package Size: 0603 (1608 Metric); Tolerance: 1%
R63 = RES: RES SMD 10K OHM 1% 1/10W 0603; PART_NUMBER: RES-00000015; Manufacturer: Yageo; Manufacturer PN: RC0603FR-0710KL; ALT_SYMBOLS: r_0603_hd; Temperature Coefficient: 100ppm/C; Rated Power: 0.1W, 1/10W; CLASS: DISCRETE; Package Size: 0603 (1608 Metric); Tolerance: 1%
R64-R66 = RES: RES SMD 22K OHM 1% 1/10W 0402; PART_NUMBER: TMP-751; Manufacturer: Panasonic Electronic Components; Manufacturer PN: ERJ-2RKF2202X; Temperature Coefficient: 100ppm/C; Rated Power: 0.1W, 1/10W; CLASS: DISCRETE; Package Size: 0402 (1005 Metric); Tolerance: 1%
R67 R69 R70 = RES: as R5 on sheet DAUGHTERBOARD; Package Size: 0402 (1005 Metric); Tolerance: 1%
R68 = RES: RES SMD 169K OHM 1% 1/16W 0402; PART_NUMBER: TMP-424; Manufacturer: Yageo; Manufacturer PN: RC0402FR-07169KL; Temperature Coefficient: 100ppm/C; Rated Power: 0.063W, 1/16W; CLASS: DISCRETE; Package Size: 0402 (1005 Metric); Tolerance: 1%
R71 = RES: as R10 on sheet DAUGHTERBOARD; Package Size: 0402 (1005 Metric); Tolerance: 1%
R72 R73 = RES: as R3 on sheet DAUGHTERBOARD; Tolerance: 1%; Package Size: 0402 (1005 Metric)
R74 = RES: RES SMD 1.8K OHM 1% 1/16W 0402; Manufacturer PN: RC0402FR-071K8L; Manufacturer: Yageo; PART_NUMBER: TMP-394; CLASS: DISCRETE; Rated Power: 0.063W, 1/16W; Temperature Coefficient: 100ppm/C; Tolerance: 1%; Package Size: 0402 (1005 Metric)
R75 R77 = RES: RES SMD 1.8K OHM 1% 1/16W 0402; PART_NUMBER: TMP-394; Manufacturer: Yageo; Manufacturer PN: RC0402FR-071K8L; Temperature Coefficient: 100ppm/C; Rated Power: 0.063W, 1/16W; CLASS: DISCRETE; Package Size: 0402 (1005 Metric); Tolerance: 1%
R76 = RES: RES SMD 18K OHM 1% 1/16W 0402; PART_NUMBER: TMP-425; Manufacturer: Yageo; Manufacturer PN: RC0402FR-0718KL; Temperature Coefficient: 100ppm/C; Rated Power: 0.063W, 1/16W; CLASS: DISCRETE; Package Size: 0402 (1005 Metric); Tolerance: 1%
R80-R82 = RES: RES SMD 2.2K OHM 1% 1/16W 0402; PART_NUMBER: TMP-444; Manufacturer: Yageo; Manufacturer PN: RC0402FR-072K2L; Temperature Coefficient: 100ppm/C; Rated Power: 0.063W, 1/16W; CLASS: DISCRETE; Package Size: 0402 (1005 Metric); Tolerance: 1%
RT1 = NTC: NTC THERMISTOR 10K OHM 1% 0402; Manufacturer PN: NTCG103JF103FT1; Manufacturer: TDK Corporation; PART_NUMBER: TMP-423; CLASS: DISCRETE; Package Size: 0402 (1005 Metric)